# Altium project Mainboard.PrjPCB (part 1 of 2)
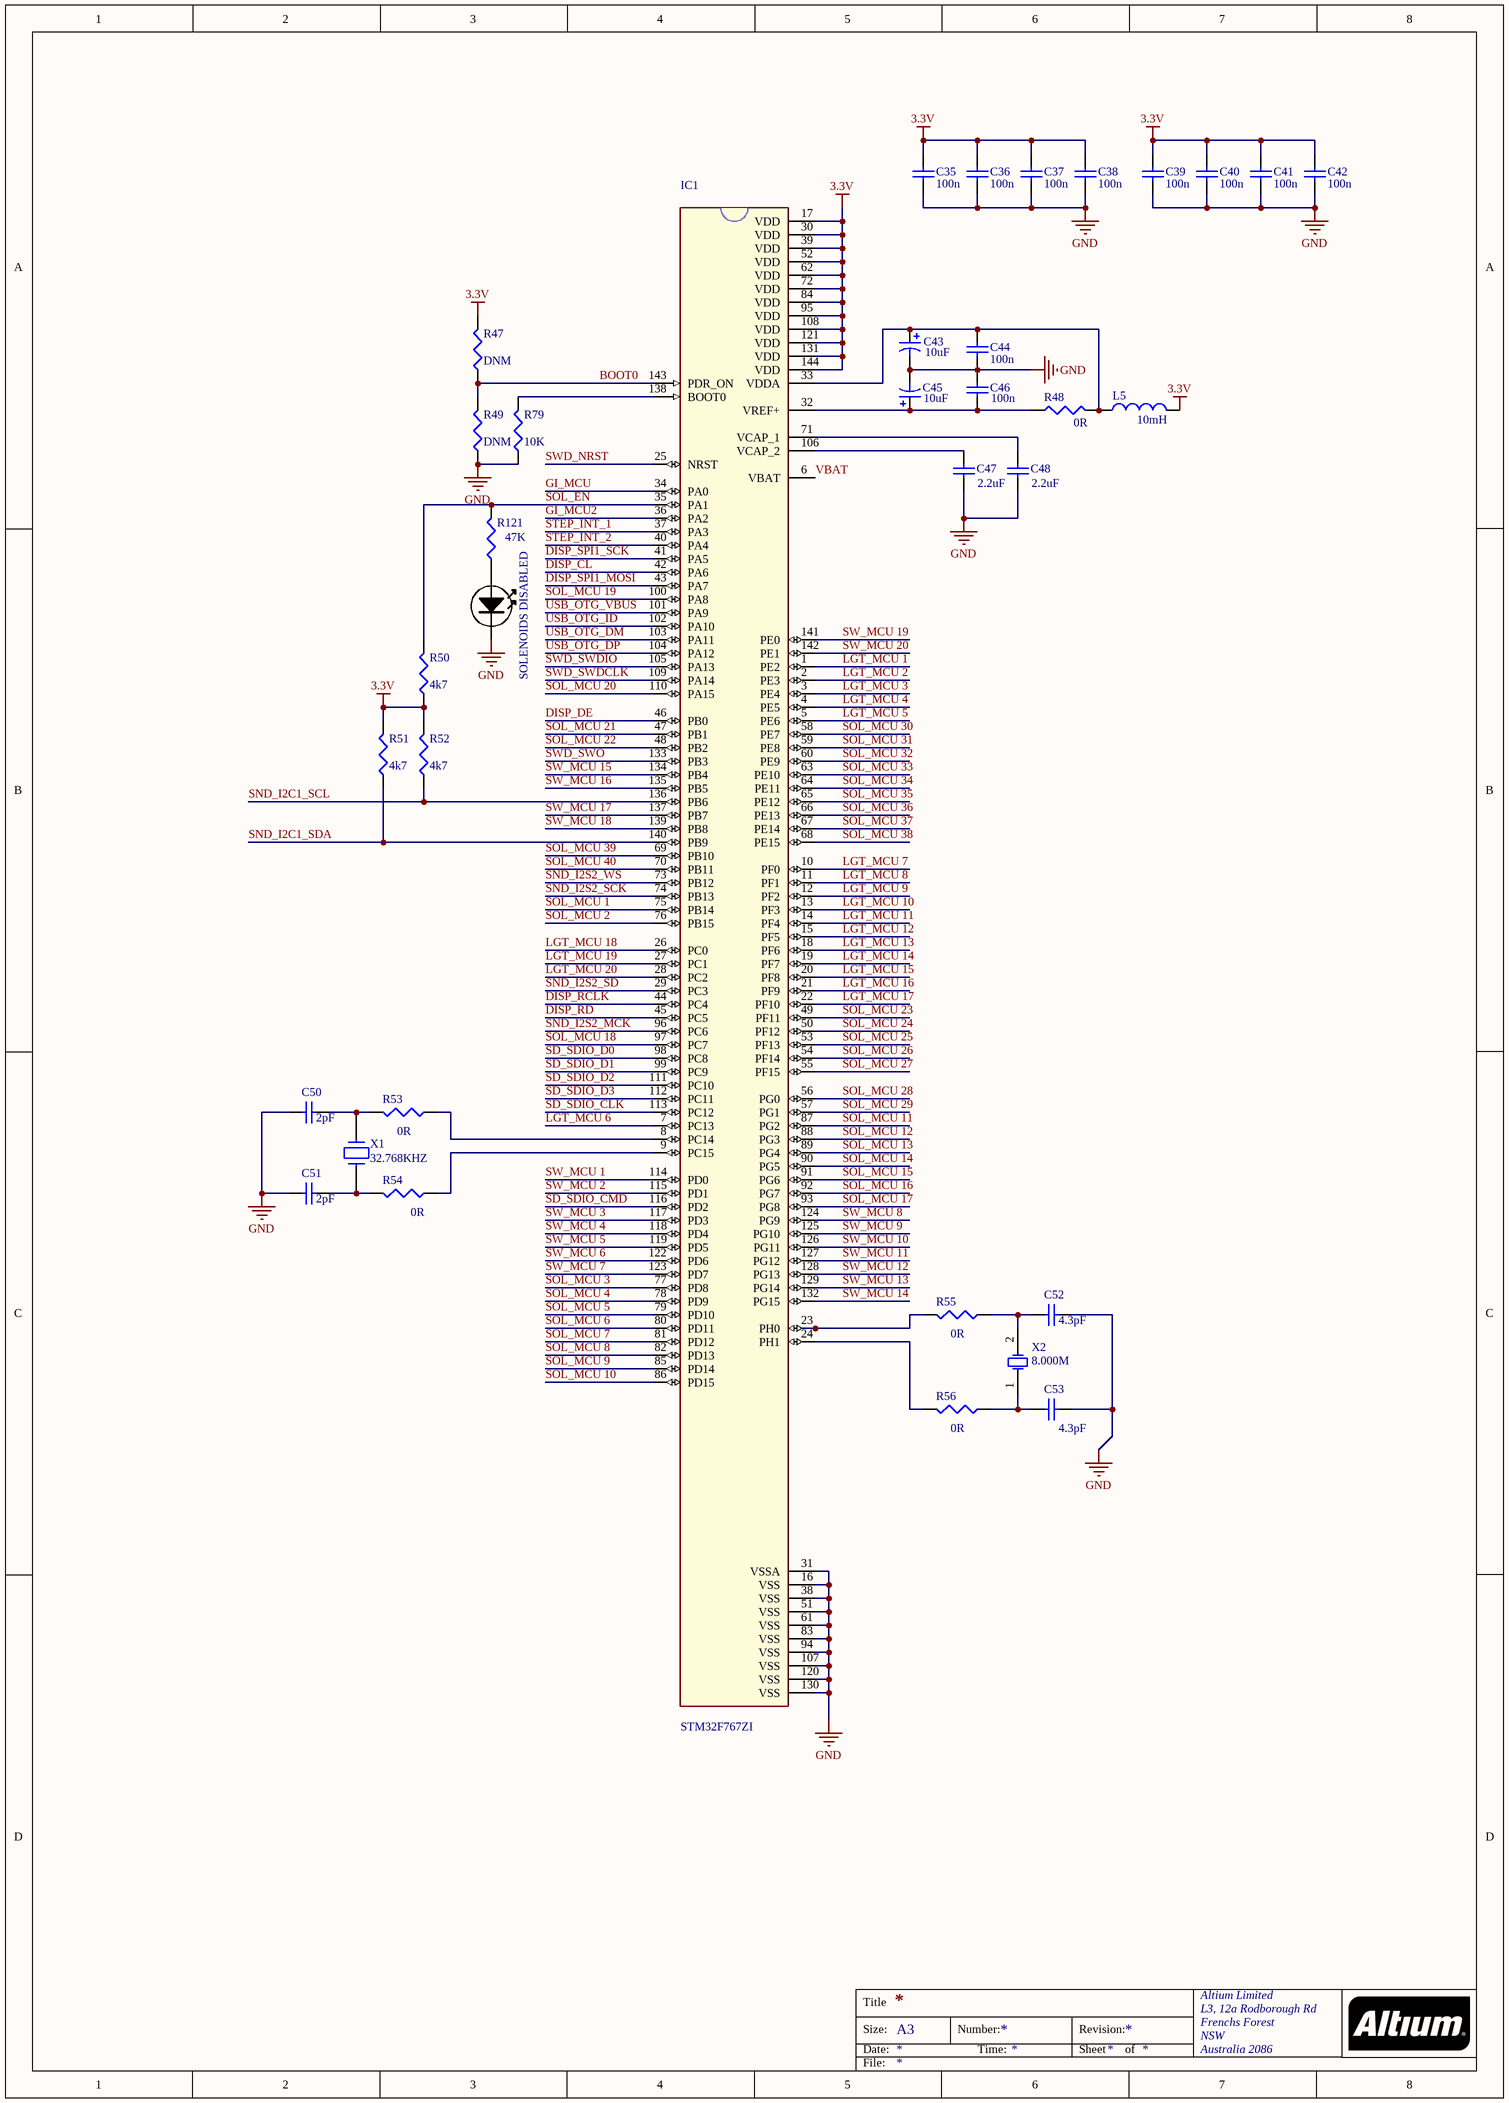
[diagram p0: Microcontroller.SchDoc]
8 sheets, 334 parts. Net scope: global (net labels, ports and power ports of the same name join across sheets).
Board file: PCB.PcbDoc
Sheets:
  Microcontroller.SchDoc
  Solenoid and Flasher Driver.SchDoc
  Dot Matrix Display Driver.SchDoc
  Connectors.SchDoc
  Stepper Motor Driver.SchDoc
  Switch Matrix Driver.SchDoc
  Lamp Matrix and GI Driver.SchDoc
  Digital Audio Amp.SchDoc

## Sheet Microcontroller.SchDoc
size A3 portrait; Organization: Altium Limited; Address1: L3, 12a Rodborough Rd; Address2: Frenchs Forest; Address3: NSW; Address4: Australia 2086

### Parts
C35  value 100n  [0805C-GENERIC]  (hidden comment: Cap Semi)
C36  value 100n  [0805C-GENERIC]  (hidden comment: Cap Semi)
C37  value 100n  [0805C-GENERIC]  (hidden comment: Cap Semi)
C38  value 100n  [0805C-GENERIC]  (hidden comment: Cap Semi)
C39  value 100n  [0805C-GENERIC]  (hidden comment: Cap Semi)
C40  value 100n  [0805C-GENERIC]  (hidden comment: Cap Semi)
C41  value 100n  [0805C-GENERIC]  (hidden comment: Cap Semi)
C42  value 100n  [0805C-GENERIC]  (hidden comment: Cap Semi)
C43  value 10uF  [0805C-GENERIC]  (hidden comment: Cap Pol3)
C44  value 100n  [0805C-GENERIC]  (hidden comment: Cap Semi)
C45  value 10uF  [0805C-GENERIC]  (hidden comment: Cap Pol3)
C46  value 100n  [0805C-GENERIC]  (hidden comment: Cap Semi)
C47  value 2.2uF  [0805C-GENERIC]  (hidden comment: Cap Semi)
C48  value 2.2uF  [0805C-GENERIC]  (hidden comment: Cap Semi)
C50  value 2pF  [0805C-GENERIC]  (hidden comment: Cap Semi)
C51  value 2pF  [0805C-GENERIC]  (hidden comment: Cap Semi)
C52  value 4.3pF  [0805C-GENERIC]  (hidden comment: Cap Semi)
C53  value 4.3pF  [0805C-GENERIC]  (hidden comment: Cap Semi)
IC1  STM32F767ZI  [TSQFP50P2200X2200X160-144N]
L5  value 10mH  [0805FB-GENERIC]  (hidden comment: Inductor)
R47  value DNM  [0805R-GENERIC]  (hidden comment: Res3)
R48  value 0R  [0805R-GENERIC]  (hidden comment: Res3)
R49  value DNM  [0805R-GENERIC]  (hidden comment: Res3)
R50  value 4k7  [0805R-GENERIC]  (hidden comment: Res3)
R51  value 4k7  [0805R-GENERIC]  (hidden comment: Res3)
R52  value 4k7  [0805R-GENERIC]  (hidden comment: Res3)
R53  value 0R  [0805R-GENERIC]  (hidden comment: Res3)
R54  value 0R  [0805R-GENERIC]  (hidden comment: Res3)
R55  value 0R  [0805R-GENERIC]  (hidden comment: Res3)
R56  value 0R  [0805R-GENERIC]  (hidden comment: Res3)
R79  value 10K  [0805R-GENERIC]  (hidden comment: Res3)
R121  value 47K  [0805R-GENERIC]  (hidden comment: Res3)
SOLENOIDS_DISABLED  LED-RED-3MM  [LED-3MM-RED]  (value not drawn)
X1  32.768KHZ  [XTAL_2SM_3R2X1R5]
X2  8.000M  [OSC_2SM_3R2x2R5]

### Nets
3.3V: C35.2 C36.2 C37.2 C38.2 C39.2 C40.2 C41.2 C42.2 IC1.17(VDD) IC1.30(VDD) IC1.39(VDD) IC1.52(VDD) IC1.62(VDD) IC1.72(VDD) IC1.84(VDD) IC1.95(VDD) IC1.108(VDD) IC1.121(VDD) IC1.131(VDD) IC1.144(VDD) L5.2 R47.2 R50.1 R51.2 R52.2
GND: C35.1 C36.1 C37.1 C38.1 C39.1 C40.1 C41.1 C42.1 C43.2 C44.1 C45.2 C46.2 C47.1 C48.1 C50.1 C51.1 C52.2 C53.2 IC1.16(VSS) IC1.31(VSSA) IC1.38(VSS) IC1.51(VSS) IC1.61(VSS) IC1.83(VSS) IC1.94(VSS) IC1.107(VSS) IC1.120(VSS) IC1.130(VSS) R49.1 R79.1 SOLENOIDS_DISABLED.K
BOOT0: IC1.143(PDR_ON) R47.1 R49.2
DISP_CL: IC1.42(PA6)
DISP_DE: IC1.46(PB0)
DISP_RCLK: IC1.44(PC4)
DISP_RD: IC1.45(PC5)
DISP_SPI1_MOSI: IC1.43(PA7)
DISP_SPI1_SCK: IC1.41(PA5)
GI_MCU: IC1.34(PA0)
GI_MCU2: IC1.36(PA2)
LGT_MCU 1: IC1.1(PE2)
LGT_MCU 2: IC1.2(PE3)
LGT_MCU 3: IC1.3(PE4)
LGT_MCU 4: IC1.4(PE5)
LGT_MCU 5: IC1.5(PE6)
LGT_MCU 6: IC1.7(PC13)
LGT_MCU 7: IC1.10(PF0)
LGT_MCU 8: IC1.11(PF1)
LGT_MCU 9: IC1.12(PF2)
LGT_MCU 10: IC1.13(PF3)
LGT_MCU 11: IC1.14(PF4)
LGT_MCU 12: IC1.15(PF5)
LGT_MCU 13: IC1.18(PF6)
LGT_MCU 14: IC1.19(PF7)
LGT_MCU 15: IC1.20(PF8)
LGT_MCU 16: IC1.21(PF9)
LGT_MCU 17: IC1.22(PF10)
LGT_MCU 18: IC1.26(PC0)
LGT_MCU 19: IC1.27(PC1)
LGT_MCU 20: IC1.28(PC2)
SD_SDIO_CLK: IC1.113(PC12)
SD_SDIO_CMD: IC1.116(PD2)
SD_SDIO_D0: IC1.98(PC8)
SD_SDIO_D1: IC1.99(PC9)
SD_SDIO_D2: IC1.111(PC10)
SD_SDIO_D3: IC1.112(PC11)
SND_I2C1_SCL: IC1.136(PB6) R52.1
SND_I2C1_SDA: IC1.140(PB9) R51.1
SND_I2S2_MCK: IC1.96(PC6)
SND_I2S2_SCK: IC1.74(PB13)
SND_I2S2_SD: IC1.29(PC3)
SND_I2S2_WS: IC1.73(PB12)
SOL_EN: IC1.35(PA1) R50.2 R121.2
SOL_MCU 1: IC1.75(PB14)
SOL_MCU 2: IC1.76(PB15)
SOL_MCU 3: IC1.77(PD8)
SOL_MCU 4: IC1.78(PD9)
SOL_MCU 5: IC1.79(PD10)
SOL_MCU 6: IC1.80(PD11)
SOL_MCU 7: IC1.81(PD12)
SOL_MCU 8: IC1.82(PD13)
SOL_MCU 9: IC1.85(PD14)
SOL_MCU 10: IC1.86(PD15)
SOL_MCU 11: IC1.87(PG2)
SOL_MCU 12: IC1.88(PG3)
SOL_MCU 13: IC1.89(PG4)
SOL_MCU 14: IC1.90(PG5)
SOL_MCU 15: IC1.91(PG6)
SOL_MCU 16: IC1.92(PG7)
SOL_MCU 17: IC1.93(PG8)
SOL_MCU 18: IC1.97(PC7)
SOL_MCU 19: IC1.100(PA8)
SOL_MCU 20: IC1.110(PA15)
SOL_MCU 21: IC1.47(PB1)
SOL_MCU 22: IC1.48(PB2)
SOL_MCU 23: IC1.49(PF11)
SOL_MCU 24: IC1.50(PF12)
SOL_MCU 25: IC1.53(PF13)
SOL_MCU 26: IC1.54(PF14)
SOL_MCU 27: IC1.55(PF15)
SOL_MCU 28: IC1.56(PG0)
SOL_MCU 29: IC1.57(PG1)
SOL_MCU 30: IC1.58(PE7)
SOL_MCU 31: IC1.59(PE8)
SOL_MCU 32: IC1.60(PE9)
SOL_MCU 33: IC1.63(PE10)
SOL_MCU 34: IC1.64(PE11)
SOL_MCU 35: IC1.65(PE12)
SOL_MCU 36: IC1.66(PE13)
SOL_MCU 37: IC1.67(PE14)
SOL_MCU 38: IC1.68(PE15)
SOL_MCU 39: IC1.69(PB10)
SOL_MCU 40: IC1.70(PB11)
STEP_INT_1: IC1.37(PA3)
STEP_INT_2: IC1.40(PA4)
SW_MCU 1: IC1.114(PD0)
SW_MCU 2: IC1.115(PD1)
SW_MCU 3: IC1.117(PD3)
SW_MCU 4: IC1.118(PD4)
SW_MCU 5: IC1.119(PD5)
SW_MCU 6: IC1.122(PD6)
SW_MCU 7: IC1.123(PD7)
SW_MCU 8: IC1.124(PG9)
SW_MCU 9: IC1.125(PG10)
SW_MCU 10: IC1.126(PG11)
SW_MCU 11: IC1.127(PG12)
SW_MCU 12: IC1.128(PG13)
SW_MCU 13: IC1.129(PG14)
SW_MCU 14: IC1.132(PG15)
SW_MCU 15: IC1.134(PB4)
SW_MCU 16: IC1.135(PB5)
SW_MCU 17: IC1.137(PB7)
SW_MCU 18: IC1.139(PB8)
SW_MCU 19: IC1.141(PE0)
SW_MCU 20: IC1.142(PE1)
SWD_NRST: IC1.25(NRST)
SWD_SWDCLK: IC1.109(PA14)
SWD_SWDIO: IC1.105(PA13)
SWD_SWO: IC1.133(PB3)
USB_OTG_DM: IC1.103(PA11)
USB_OTG_DP: IC1.104(PA12)
USB_OTG_ID: IC1.102(PA10)
USB_OTG_VBUS: IC1.101(PA9)
VBAT: IC1.6(VBAT)
NetC43_1: C43.1 C44.2 IC1.33(VDDA) L5.1 R48.2
NetC45_1: C45.1 C46.1 IC1.32(VREF+) R48.1
NetC47_2: C47.2 IC1.106(VCAP_2)
NetC48_2: C48.2 IC1.71(VCAP_1)
NetC50_2: C50.2 R53.2 X1.2
NetC51_2: C51.2 R54.2 X1.1
NetC52_1: C52.1 R55.1 X2.2(OSC2)
NetC53_1: C53.1 R56.1 X2.1(OSC1)
NetIC1_8: IC1.8(PC14) R53.1
NetIC1_9: IC1.9(PC15) R54.1
NetIC1_23: IC1.23(PH0) R55.2
NetIC1_24: IC1.24(PH1) R56.2
NetIC1_138: IC1.138(BOOT0) R79.2
NetR121_1: R121.1 SOLENOIDS_DISABLED.A

### Notes on the sheet
- Title
- Size:
- Date:
- A3
- Number:
- Time:
- Revision:
- Sheet
- of
- File:

### Library data of the parts
C35-C42 C44 C46-C48 C50-C53 = Cap Semi: Capacitor (Semiconductor SIM Model); Published: 8-Jun-2000; LatestRevisionDate: 29-May-2009; LatestRevisionNote: IPC-7351 Footprint Added.; PackageReference: C1206; Publisher: Altium Limited; PackageDescription: Chip Capacitor
C43 C45 = Cap Pol3: Polarized Capacitor (Surface Mount); Published: 8-Jun-2000; LatestRevisionDate: 29-May-2009; LatestRevisionNote: IPC-7351 Footprint Added.; PackageReference: C0805; Publisher: Altium Limited; PackageDescription: Chip Capacitor
IC1 = STM32F407ZGT6: IC MCU 32BIT 1MB FLASH 144LQFP; MF: STMicroelectronics; MP: STM32F407ZGT6; Availability: Good; Package: LQFP-144 STMicroelectronics; Price: 11.63 USD; Value: *
L5 = Inductor: Code_IEC: 1005; Published: 8-Jun-2000; LatestRevisionDate: 29-May-2009; LatestRevisionNote: IPC-7351 Footprint Added.; PackageReference: 0402-A; Publisher: Altium Limited; PackageDescription: Chip Inductor; Code_JEITA: 0402
R47-R56 R79 R121 = Res3: Resistor; Published: 8-Jun-2000; LatestRevisionDate: 29-May-2009; LatestRevisionNote: IPC-7351 Footprint Added.; PackageReference: J1-0603; Publisher: Altium Limited; PackageDescription: Chip Resistor
X1 = CRYSTAL_32K: Crystal
X2 = XTAL: Crystal Oscillator; Published: 8-Jun-2000; LatestRevisionDate: 17-Jul-2002; LatestRevisionNote: Re-released for DXP Platform.; PackageReference: R38; Publisher: Altium Limited

## Sheet Solenoid and Flasher Driver.SchDoc
size A3 portrait; Organization: Altium Limited; Address1: L3, 12a Rodborough Rd; Address2: Frenchs Forest; Address3: NSW; Address4: Australia 2086
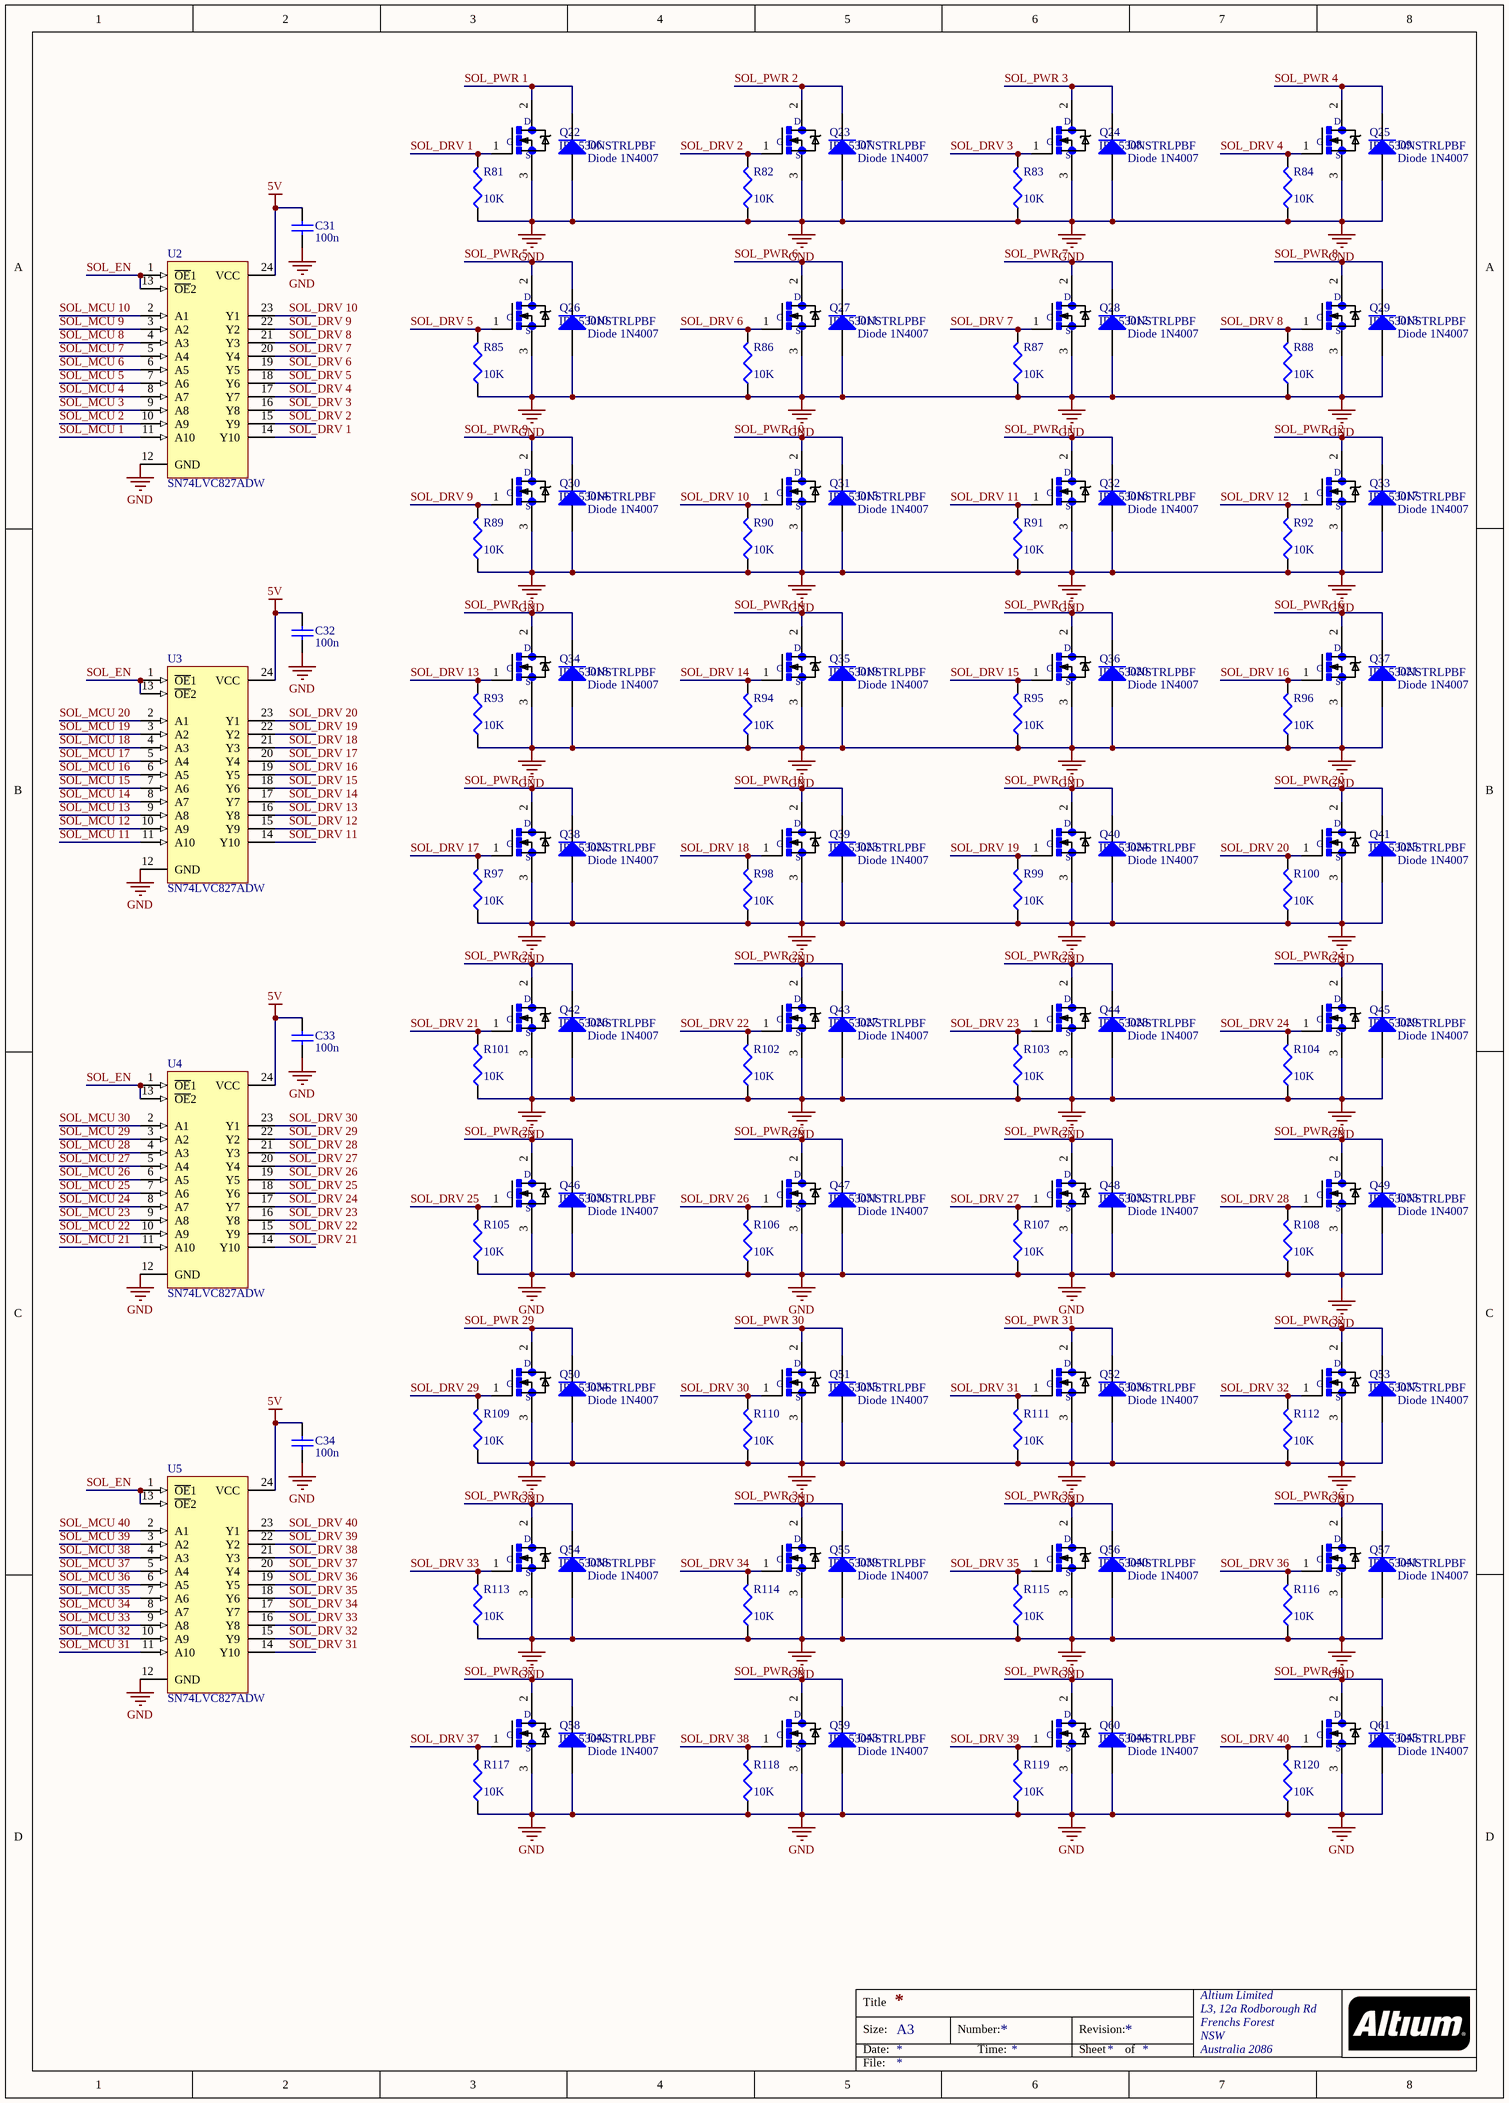
[diagram p1: Solenoid and Flasher Driver.SchDoc]

### Parts
C31  value 100n  [0805C-GENERIC]  (hidden comment: Cap Semi)
C32  value 100n  [0805C-GENERIC]  (hidden comment: Cap Semi)
C33  value 100n  [0805C-GENERIC]  (hidden comment: Cap Semi)
C34  value 100n  [0805C-GENERIC]  (hidden comment: Cap Semi)
D6  Diode 1N4007  [DO-41]
D7  Diode 1N4007  [DO-41]
D8  Diode 1N4007  [DO-41]
D9  Diode 1N4007  [DO-41]
D10  Diode 1N4007  [DO-41]
D11  Diode 1N4007  [DO-41]
D12  Diode 1N4007  [DO-41]
D13  Diode 1N4007  [DO-41]
D14  Diode 1N4007  [DO-41]
D15  Diode 1N4007  [DO-41]
D16  Diode 1N4007  [DO-41]
D17  Diode 1N4007  [DO-41]
D18  Diode 1N4007  [DO-41]
D19  Diode 1N4007  [DO-41]
D20  Diode 1N4007  [DO-41]
D21  Diode 1N4007  [DO-41]
D22  Diode 1N4007  [DO-41]
D23  Diode 1N4007  [DO-41]
D24  Diode 1N4007  [DO-41]
D25  Diode 1N4007  [DO-41]
D26  Diode 1N4007  [DO-41]
D27  Diode 1N4007  [DO-41]
D28  Diode 1N4007  [DO-41]
D29  Diode 1N4007  [DO-41]
D30  Diode 1N4007  [DO-41]
D31  Diode 1N4007  [DO-41]
D32  Diode 1N4007  [DO-41]
D33  Diode 1N4007  [DO-41]
D34  Diode 1N4007  [DO-41]
D35  Diode 1N4007  [DO-41]
D36  Diode 1N4007  [DO-41]
D37  Diode 1N4007  [DO-41]
D38  Diode 1N4007  [DO-41]
D39  Diode 1N4007  [DO-41]
D40  Diode 1N4007  [DO-41]
D41  Diode 1N4007  [DO-41]
D42  Diode 1N4007  [DO-41]
D43  Diode 1N4007  [DO-41]
D44  Diode 1N4007  [DO-41]
D45  Diode 1N4007  [DO-41]
Q22  IRL530NSTRLPBF  [TO-220AB]
Q23  IRL530NSTRLPBF  [TO-220AB]
Q24  IRL530NSTRLPBF  [TO-220AB]
Q25  IRL530NSTRLPBF  [TO-220AB]
Q26  IRL530NSTRLPBF  [TO-220AB]
Q27  IRL530NSTRLPBF  [TO-220AB]
Q28  IRL530NSTRLPBF  [TO-220AB]
Q29  IRL530NSTRLPBF  [TO-220AB]
Q30  IRL530NSTRLPBF  [TO-220AB]
Q31  IRL530NSTRLPBF  [TO-220AB]
Q32  IRL530NSTRLPBF  [TO-220AB]
Q33  IRL530NSTRLPBF  [TO-220AB]
Q34  IRL530NSTRLPBF  [TO-220AB]
Q35  IRL530NSTRLPBF  [TO-220AB]
Q36  IRL530NSTRLPBF  [TO-220AB]
Q37  IRL530NSTRLPBF  [TO-220AB]
Q38  IRL530NSTRLPBF  [TO-220AB]
Q39  IRL530NSTRLPBF  [TO-220AB]
Q40  IRL530NSTRLPBF  [TO-220AB]
Q41  IRL530NSTRLPBF  [TO-220AB]
Q42  IRL530NSTRLPBF  [TO-220AB]
Q43  IRL530NSTRLPBF  [TO-220AB]
Q44  IRL530NSTRLPBF  [TO-220AB]
Q45  IRL530NSTRLPBF  [TO-220AB]
Q46  IRL530NSTRLPBF  [TO-220AB]
Q47  IRL530NSTRLPBF  [TO-220AB]
Q48  IRL530NSTRLPBF  [TO-220AB]
Q49  IRL530NSTRLPBF  [TO-220AB]
Q50  IRL530NSTRLPBF  [TO-220AB]
Q51  IRL530NSTRLPBF  [TO-220AB]
Q52  IRL530NSTRLPBF  [TO-220AB]
Q53  IRL530NSTRLPBF  [TO-220AB]
Q54  IRL530NSTRLPBF  [TO-220AB]
Q55  IRL530NSTRLPBF  [TO-220AB]
Q56  IRL530NSTRLPBF  [TO-220AB]
Q57  IRL530NSTRLPBF  [TO-220AB]
Q58  IRL530NSTRLPBF  [TO-220AB]
Q59  IRL530NSTRLPBF  [TO-220AB]
Q60  IRL530NSTRLPBF  [TO-220AB]
Q61  IRL530NSTRLPBF  [TO-220AB]
R81  value 10K  [0805R-GENERIC]  (hidden comment: Res3)
R82  value 10K  [0805R-GENERIC]  (hidden comment: Res3)
R83  value 10K  [0805R-GENERIC]  (hidden comment: Res3)
R84  value 10K  [0805R-GENERIC]  (hidden comment: Res3)
R85  value 10K  [0805R-GENERIC]  (hidden comment: Res3)
R86  value 10K  [0805R-GENERIC]  (hidden comment: Res3)
R87  value 10K  [0805R-GENERIC]  (hidden comment: Res3)
R88  value 10K  [0805R-GENERIC]  (hidden comment: Res3)
R89  value 10K  [0805R-GENERIC]  (hidden comment: Res3)
R90  value 10K  [0805R-GENERIC]  (hidden comment: Res3)
R91  value 10K  [0805R-GENERIC]  (hidden comment: Res3)
R92  value 10K  [0805R-GENERIC]  (hidden comment: Res3)
R93  value 10K  [0805R-GENERIC]  (hidden comment: Res3)
R94  value 10K  [0805R-GENERIC]  (hidden comment: Res3)
R95  value 10K  [0805R-GENERIC]  (hidden comment: Res3)
R96  value 10K  [0805R-GENERIC]  (hidden comment: Res3)
R97  value 10K  [0805R-GENERIC]  (hidden comment: Res3)
R98  value 10K  [0805R-GENERIC]  (hidden comment: Res3)
R99  value 10K  [0805R-GENERIC]  (hidden comment: Res3)
R100  value 10K  [0805R-GENERIC]  (hidden comment: Res3)
R101  value 10K  [0805R-GENERIC]  (hidden comment: Res3)
R102  value 10K  [0805R-GENERIC]  (hidden comment: Res3)
R103  value 10K  [0805R-GENERIC]  (hidden comment: Res3)
R104  value 10K  [0805R-GENERIC]  (hidden comment: Res3)
R105  value 10K  [0805R-GENERIC]  (hidden comment: Res3)
R106  value 10K  [0805R-GENERIC]  (hidden comment: Res3)
R107  value 10K  [0805R-GENERIC]  (hidden comment: Res3)
R108  value 10K  [0805R-GENERIC]  (hidden comment: Res3)
R109  value 10K  [0805R-GENERIC]  (hidden comment: Res3)
R110  value 10K  [0805R-GENERIC]  (hidden comment: Res3)
R111  value 10K  [0805R-GENERIC]  (hidden comment: Res3)
R112  value 10K  [0805R-GENERIC]  (hidden comment: Res3)
R113  value 10K  [0805R-GENERIC]  (hidden comment: Res3)
R114  value 10K  [0805R-GENERIC]  (hidden comment: Res3)
R115  value 10K  [0805R-GENERIC]  (hidden comment: Res3)
R116  value 10K  [0805R-GENERIC]  (hidden comment: Res3)
R117  value 10K  [0805R-GENERIC]  (hidden comment: Res3)
R118  value 10K  [0805R-GENERIC]  (hidden comment: Res3)
R119  value 10K  [0805R-GENERIC]  (hidden comment: Res3)
R120  value 10K  [0805R-GENERIC]  (hidden comment: Res3)
U2  SN74LVC827ADW  [SOIC24]
U3  SN74LVC827ADW  [SOIC24]
U4  SN74LVC827ADW  [SOIC24]
U5  SN74LVC827ADW  [SOIC24]

### Nets
5V: C31.2 C32.2 C33.2 C34.2 U2.24(VCC) U3.24(VCC) U4.24(VCC) U5.24(VCC)
GND: C31.1 C32.1 C33.1 C34.1 D6.1(A) D7.1(A) D8.1(A) D9.1(A) D10.1(A) D11.1(A) D12.1(A) D13.1(A) D14.1(A) D15.1(A) D16.1(A) D17.1(A) D18.1(A) D19.1(A) D20.1(A) D21.1(A) D22.1(A) D23.1(A) D24.1(A) D25.1(A) D26.1(A) D27.1(A) D28.1(A) D29.1(A) D30.1(A) D31.1(A) D32.1(A) D33.1(A) D34.1(A) D35.1(A) D36.1(A) D37.1(A) D38.1(A) D39.1(A) D40.1(A) D41.1(A) D42.1(A) D43.1(A) D44.1(A) D45.1(A) Q22.3(S) Q23.3(S) Q24.3(S) Q25.3(S) Q26.3(S) Q27.3(S) Q28.3(S) Q29.3(S) Q30.3(S) Q31.3(S) Q32.3(S) Q33.3(S) Q34.3(S) Q35.3(S) Q36.3(S) Q37.3(S) Q38.3(S) Q39.3(S) Q40.3(S) Q41.3(S) Q42.3(S) Q43.3(S) Q44.3(S) Q45.3(S) Q46.3(S) Q47.3(S) Q48.3(S) Q49.3(S) Q50.3(S) Q51.3(S) Q52.3(S) Q53.3(S) Q54.3(S) Q55.3(S) Q56.3(S) Q57.3(S) Q58.3(S) Q59.3(S) Q60.3(S) Q61.3(S) R81.1 R82.1 R83.1 R84.1 R85.1 R86.1 R87.1 R88.1 R89.1 R90.1 R91.1 R92.1 R93.1 R94.1 R95.1 R96.1 R97.1 R98.1 R99.1 R100.1 R101.1 R102.1 R103.1 R104.1 R105.1 R106.1 R107.1 R108.1 R109.1 R110.1 R111.1 R112.1 R113.1 R114.1 R115.1 R116.1 R117.1 R118.1 R119.1 R120.1 U2.12(GND) U3.12(GND) U4.12(GND) U5.12(GND)
SOL_DRV 1: Q22.1(G) R81.2 U2.14(Y10)
SOL_DRV 2: Q23.1(G) R82.2 U2.15(Y9)
SOL_DRV 3: Q24.1(G) R83.2 U2.16(Y8)
SOL_DRV 4: Q25.1(G) R84.2 U2.17(Y7)
SOL_DRV 5: Q26.1(G) R85.2 U2.18(Y6)
SOL_DRV 6: Q27.1(G) R86.2 U2.19(Y5)
SOL_DRV 7: Q28.1(G) R87.2 U2.20(Y4)
SOL_DRV 8: Q29.1(G) R88.2 U2.21(Y3)
SOL_DRV 9: Q30.1(G) R89.2 U2.22(Y2)
SOL_DRV 10: Q31.1(G) R90.2 U2.23(Y1)
SOL_DRV 11: Q32.1(G) R91.2 U3.14(Y10)
SOL_DRV 12: Q33.1(G) R92.2 U3.15(Y9)
SOL_DRV 13: Q34.1(G) R93.2 U3.16(Y8)
SOL_DRV 14: Q35.1(G) R94.2 U3.17(Y7)
SOL_DRV 15: Q36.1(G) R95.2 U3.18(Y6)
SOL_DRV 16: Q37.1(G) R96.2 U3.19(Y5)
SOL_DRV 17: Q38.1(G) R97.2 U3.20(Y4)
SOL_DRV 18: Q39.1(G) R98.2 U3.21(Y3)
SOL_DRV 19: Q40.1(G) R99.2 U3.22(Y2)
SOL_DRV 20: Q41.1(G) R100.2 U3.23(Y1)
SOL_DRV 21: Q42.1(G) R101.2 U4.14(Y10)
SOL_DRV 22: Q43.1(G) R102.2 U4.15(Y9)
SOL_DRV 23: Q44.1(G) R103.2 U4.16(Y8)
SOL_DRV 24: Q45.1(G) R104.2 U4.17(Y7)
SOL_DRV 25: Q46.1(G) R105.2 U4.18(Y6)
SOL_DRV 26: Q47.1(G) R106.2 U4.19(Y5)
SOL_DRV 27: Q48.1(G) R107.2 U4.20(Y4)
SOL_DRV 28: Q49.1(G) R108.2 U4.21(Y3)
SOL_DRV 29: Q50.1(G) R109.2 U4.22(Y2)
SOL_DRV 30: Q51.1(G) R110.2 U4.23(Y1)
SOL_DRV 31: Q52.1(G) R111.2 U5.14(Y10)
SOL_DRV 32: Q53.1(G) R112.2 U5.15(Y9)
SOL_DRV 33: Q54.1(G) R113.2 U5.16(Y8)
SOL_DRV 34: Q55.1(G) R114.2 U5.17(Y7)
SOL_DRV 35: Q56.1(G) R115.2 U5.18(Y6)
SOL_DRV 36: Q57.1(G) R116.2 U5.19(Y5)
SOL_DRV 37: Q58.1(G) R117.2 U5.20(Y4)
SOL_DRV 38: Q59.1(G) R118.2 U5.21(Y3)
SOL_DRV 39: Q60.1(G) R119.2 U5.22(Y2)
SOL_DRV 40: Q61.1(G) R120.2 U5.23(Y1)
SOL_EN: U2.1(~{OE}1) U2.13(~{OE}2) U3.1(~{OE}1) U3.13(~{OE}2) U4.1(~{OE}1) U4.13(~{OE}2) U5.1(~{OE}1) U5.13(~{OE}2)
SOL_MCU 1: U2.11(A10)
SOL_MCU 2: U2.10(A9)
SOL_MCU 3: U2.9(A8)
SOL_MCU 4: U2.8(A7)
SOL_MCU 5: U2.7(A6)
SOL_MCU 6: U2.6(A5)
SOL_MCU 7: U2.5(A4)
SOL_MCU 8: U2.4(A3)
SOL_MCU 9: U2.3(A2)
SOL_MCU 10: U2.2(A1)
SOL_MCU 11: U3.11(A10)
SOL_MCU 12: U3.10(A9)
SOL_MCU 13: U3.9(A8)
SOL_MCU 14: U3.8(A7)
SOL_MCU 15: U3.7(A6)
SOL_MCU 16: U3.6(A5)
SOL_MCU 17: U3.5(A4)
SOL_MCU 18: U3.4(A3)
SOL_MCU 19: U3.3(A2)
SOL_MCU 20: U3.2(A1)
SOL_MCU 21: U4.11(A10)
SOL_MCU 22: U4.10(A9)
SOL_MCU 23: U4.9(A8)
SOL_MCU 24: U4.8(A7)
SOL_MCU 25: U4.7(A6)
SOL_MCU 26: U4.6(A5)
SOL_MCU 27: U4.5(A4)
SOL_MCU 28: U4.4(A3)
SOL_MCU 29: U4.3(A2)
SOL_MCU 30: U4.2(A1)
SOL_MCU 31: U5.11(A10)
SOL_MCU 32: U5.10(A9)
SOL_MCU 33: U5.9(A8)
SOL_MCU 34: U5.8(A7)
SOL_MCU 35: U5.7(A6)
SOL_MCU 36: U5.6(A5)
SOL_MCU 37: U5.5(A4)
SOL_MCU 38: U5.4(A3)
SOL_MCU 39: U5.3(A2)
SOL_MCU 40: U5.2(A1)
SOL_PWR 1: D6.2(K) Q22.2(D)
SOL_PWR 2: D7.2(K) Q23.2(D)
SOL_PWR 3: D8.2(K) Q24.2(D)
SOL_PWR 4: D9.2(K) Q25.2(D)
SOL_PWR 5: D10.2(K) Q26.2(D)
SOL_PWR 6: D11.2(K) Q27.2(D)
SOL_PWR 7: D12.2(K) Q28.2(D)
SOL_PWR 8: D13.2(K) Q29.2(D)
SOL_PWR 9: D14.2(K) Q30.2(D)
SOL_PWR 10: D15.2(K) Q31.2(D)
SOL_PWR 11: D16.2(K) Q32.2(D)
SOL_PWR 12: D17.2(K) Q33.2(D)
SOL_PWR 13: D18.2(K) Q34.2(D)
SOL_PWR 14: D19.2(K) Q35.2(D)
SOL_PWR 15: D20.2(K) Q36.2(D)
SOL_PWR 16: D21.2(K) Q37.2(D)
SOL_PWR 17: D22.2(K) Q38.2(D)
SOL_PWR 18: D23.2(K) Q39.2(D)
SOL_PWR 19: D24.2(K) Q40.2(D)
SOL_PWR 20: D25.2(K) Q41.2(D)
SOL_PWR 21: D26.2(K) Q42.2(D)
SOL_PWR 22: D27.2(K) Q43.2(D)
SOL_PWR 23: D28.2(K) Q44.2(D)
SOL_PWR 24: D29.2(K) Q45.2(D)
SOL_PWR 25: D30.2(K) Q46.2(D)
SOL_PWR 26: D31.2(K) Q47.2(D)
SOL_PWR 27: D32.2(K) Q48.2(D)
SOL_PWR 28: D33.2(K) Q49.2(D)
SOL_PWR 29: D34.2(K) Q50.2(D)
SOL_PWR 30: D35.2(K) Q51.2(D)
SOL_PWR 31: D36.2(K) Q52.2(D)
SOL_PWR 32: D37.2(K) Q53.2(D)
SOL_PWR 33: D38.2(K) Q54.2(D)
SOL_PWR 34: D39.2(K) Q55.2(D)
SOL_PWR 35: D40.2(K) Q56.2(D)
SOL_PWR 36: D41.2(K) Q57.2(D)
SOL_PWR 37: D42.2(K) Q58.2(D)
SOL_PWR 38: D43.2(K) Q59.2(D)
SOL_PWR 39: D44.2(K) Q60.2(D)
SOL_PWR 40: D45.2(K) Q61.2(D)

### Notes on the sheet
- Title
- Size:
- Date:
- A3
- Number:
- Time:
- Revision:
- Sheet
- of
- File:

### Library data of the parts
C31-C34 = Cap Semi: Capacitor (Semiconductor SIM Model); Published: 8-Jun-2000; LatestRevisionDate: 29-May-2009; LatestRevisionNote: IPC-7351 Footprint Added.; PackageReference: C1206; Publisher: Altium Limited; PackageDescription: Chip Capacitor
D6-D45 = Diode 1N4007: 1 Amp General Purpose Rectifier; Published: 8-Jun-2000; LatestRevisionDate: 17-Jul-2002; LatestRevisionNote: Re-released for DXP Platform.; DatasheetVersion: 1998; PackageVersion: Aug-1999; PackageReference: DO-41; Publisher: Altium Limited; PackageDescription: Diode, Axial; Body 5.2 x 2.7 mm (LxDia. max), Lead Dia. 0.86 mm (max); Code_JEDEC: DO-204-AL; ComponentLink1Description: Manufacturer Link; ComponentLink1URL: http://www.fairchildsemi.com/; ComponentLink2Description: Datasheet; ComponentLink2URL: http://www.fairchildsemi.com/ds/1N%2F1N4001.pdf
Q22-Q61 = IRL530NSTRLPBF: MOSFET N-CH 100V 17A D2PAK; MF: Infineon; Price: 0.79 USD; Package: D2PAK Infineon; Availability: Good; MP: IRL530NSTRLPBF; Value: *
R81-R120 = Res3: Resistor; Published: 8-Jun-2000; LatestRevisionDate: 29-May-2009; LatestRevisionNote: IPC-7351 Footprint Added.; PackageReference: J1-0603; Publisher: Altium Limited; PackageDescription: Chip Resistor
U2-U5 = SN74LVC827ADW: 10-Bit Buffer/Driver with 3-State Outputs; Published: 8-Jun-2000; LatestRevisionDate: 13-Apr-2006; LatestRevisionNote: IPC-7351 Footprint Added.; DatasheetVersion: Jun-1998; PackageVersion: Mar-2000; PackageReference: DW024; Publisher: Altium Limited; PackageDescription: 24-Pin Plastic Small Outline Integrated Circuit 1.27 mm Pitch; Code_JEDEC: MS-013; ComponentLink1Description: Manufacturer Link; ComponentLink1URL: http://www.ti.com/; ComponentLink2Description: Datasheet; ComponentLink2URL: http://www-s.ti.com/sc/ds/sn74lvc827a.pdf

## Sheet Dot Matrix Display Driver.SchDoc
size A4
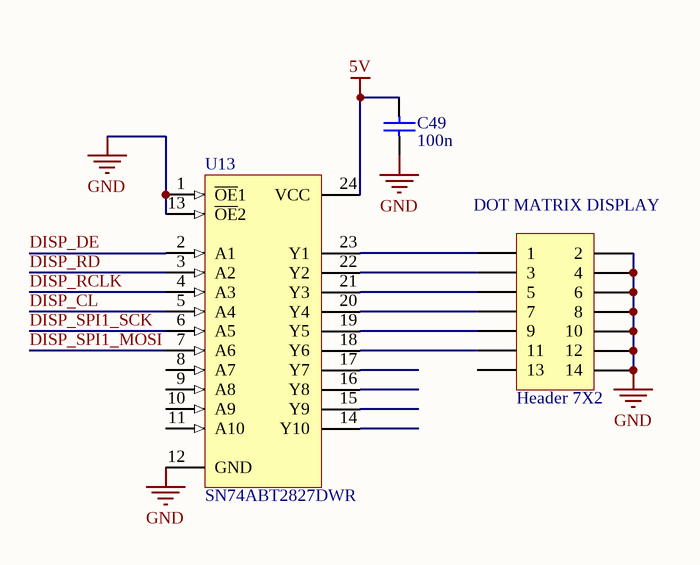
[diagram p2: Dot Matrix Display Driver.SchDoc]

### Parts
C49  value 100n  [0805C-GENERIC]  (hidden comment: Cap Semi)
DOT_MATRIX_DISPLAY  Header 7X2  [IDC14-B]
U13  SN74ABT2827DWR  [SOIC24]

### Nets
5V: C49.2 U13.24(VCC)
GND: C49.1 DOT_MATRIX_DISPLAY.2 DOT_MATRIX_DISPLAY.4 DOT_MATRIX_DISPLAY.6 DOT_MATRIX_DISPLAY.8 DOT_MATRIX_DISPLAY.10 DOT_MATRIX_DISPLAY.12 DOT_MATRIX_DISPLAY.14 U13.1(~{OE}1) U13.12(GND) U13.13(~{OE}2)
DISP_CL: U13.5(A4)
DISP_DE: U13.2(A1)
DISP_RCLK: U13.4(A3)
DISP_RD: U13.3(A2)
DISP_SPI1_MOSI: U13.7(A6)
DISP_SPI1_SCK: U13.6(A5)
NetDOT_MATRIX_DISPLAY_1: DOT_MATRIX_DISPLAY.1 U13.23(Y1)
NetDOT_MATRIX_DISPLAY_3: DOT_MATRIX_DISPLAY.3 U13.22(Y2)
NetDOT_MATRIX_DISPLAY_5: DOT_MATRIX_DISPLAY.5 U13.21(Y3)
NetDOT_MATRIX_DISPLAY_7: DOT_MATRIX_DISPLAY.7 U13.20(Y4)
NetDOT_MATRIX_DISPLAY_9: DOT_MATRIX_DISPLAY.9 U13.19(Y5)
NetDOT_MATRIX_DISPLAY_11: DOT_MATRIX_DISPLAY.11 U13.18(Y6)

Not connected (* = marked no-connect by the designer): DOT_MATRIX_DISPLAY 13; U13 8(A7) 9(A8) 10(A9) 11(A10) 14(Y10) 15(Y9) 16(Y8) 17(Y7)

### Library data of the parts
C49 = Cap Semi: Capacitor (Semiconductor SIM Model); Published: 8-Jun-2000; LatestRevisionDate: 29-May-2009; LatestRevisionNote: IPC-7351 Footprint Added.; PackageReference: C1206; Publisher: Altium Limited; PackageDescription: Chip Capacitor
DOT_MATRIX_DISPLAY = Header 7X2: Header, 7-Pin, Dual row; LatestRevisionDate: 17-Jul-2002; LatestRevisionNote: Re-released for DXP Platform.; Publisher: Altium Limited
U13 = SN74LVC827ADW: as U2 on sheet Solenoid and Flasher Driver; Published: 8-Jun-2000; LatestRevisionDate: 13-Apr-2006; LatestRevisionNote: IPC-7351 Footprint Added.; DatasheetVersion: Jun-1998; PackageVersion: Mar-2000; PackageReference: DW024; Publisher: Altium Limited; PackageDescription: 24-Pin Plastic Small Outline Integrated Circuit 1.27 mm Pitch; Code_JEDEC: MS-013; ComponentLink1Description: Manufacturer Link; ComponentLink1URL: http://www.ti.com/; ComponentLink2Description: Datasheet; ComponentLink2URL: http://www-s.ti.com/sc/ds/sn74lvc827a.pdf

## Sheet Connectors.SchDoc
size A4; Organization: Altium Limited; Address1: L3, 12a Rodborough Rd; Address2: Frenchs Forest; Address3: NSW; Address4: Australia 2086
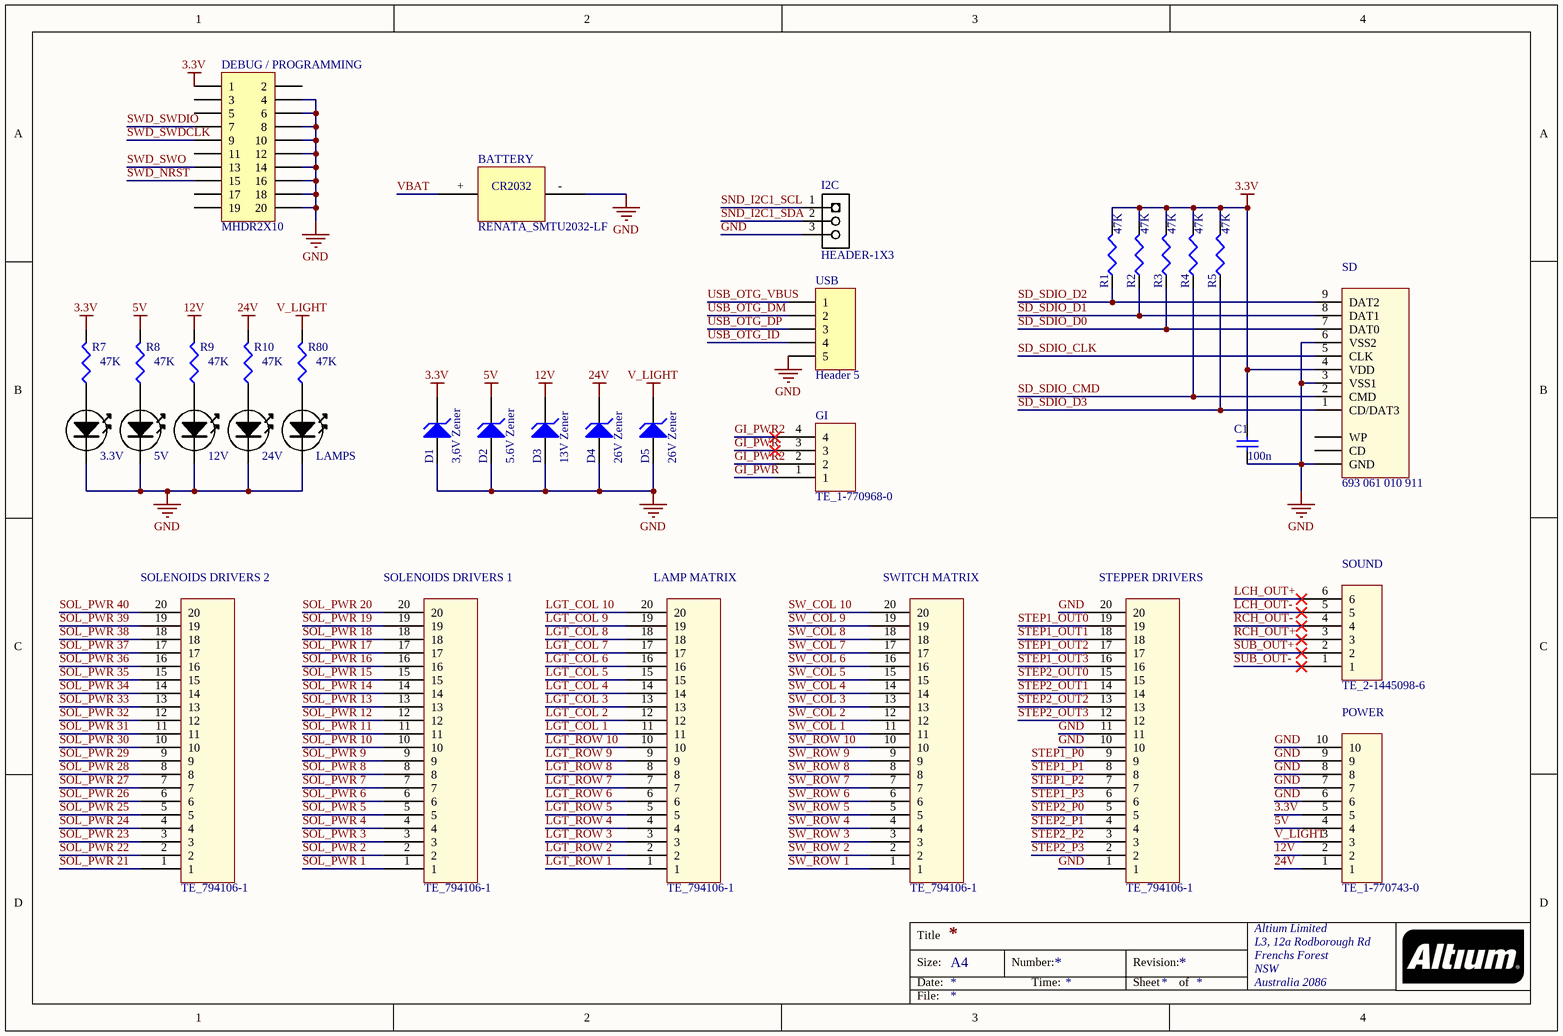
[diagram p3: Connectors.SchDoc]

### Parts
3.3V  LED-RED-3MM  [LED-3MM-RED]  (value not drawn)
5V  LED-RED-3MM  [LED-3MM-RED]  (value not drawn)
12V  LED-RED-3MM  [LED-3MM-RED]  (value not drawn)
24V  LED-RED-3MM  [LED-3MM-RED]  (value not drawn)
BATTERY  RENATA_SMTU2032-LF  [RENATA_SMTU2032-LF]
C1  value 100n  [0805C-GENERIC]  (hidden comment: Cap Semi)
D1  3,6V Zener  [DIODE-0.7]
D2  5.6V Zener  [DIODE-0.7]
D3  13V Zener  [DIODE-0.7]
D4  26V Zener  [DIODE-0.7]
D5  26V Zener  [DIODE-0.7]
DEBUG_/_PROGRAMMING  MHDR2X10  [IDC20-B]
GI  TE_1-770968-0  [TE_1-770968-0]
I2C  HEADER-1X3  [HEADER-1X3]
LAMP_MATRIX  TE_794106-1  [TE_794106-1]
LAMPS  LED-RED-3MM  [LED-3MM-RED]  (value not drawn)
POWER  TE_1-770743-0  [TE_1-770743-0]
R1  value 47K  [0805R-GENERIC]  (hidden comment: Res3)
R2  value 47K  [0805R-GENERIC]  (hidden comment: Res3)
R3  value 47K  [0805R-GENERIC]  (hidden comment: Res3)
R4  value 47K  [0805R-GENERIC]  (hidden comment: Res3)
R5  value 47K  [0805R-GENERIC]  (hidden comment: Res3)
R7  value 47K  [0805R-GENERIC]  (hidden comment: Res3)
R8  value 47K  [0805R-GENERIC]  (hidden comment: Res3)
R9  value 47K  [0805R-GENERIC]  (hidden comment: Res3)
R10  value 47K  [0805R-GENERIC]  (hidden comment: Res3)
R80  value 47K  [0805R-GENERIC]  (hidden comment: Res3)
SD  693 061 010 911  [693061010911]
SOLENOIDS_DRIVERS_1  TE_794106-1  [TE_794106-1]
SOLENOIDS_DRIVERS_2  TE_794106-1  [TE_794106-1]
SOUND  TE_2-1445098-6  [TE_2-1445098-6]
STEPPER_DRIVERS  TE_794106-1  [TE_794106-1]
SWITCH_MATRIX  TE_794106-1  [TE_794106-1]
USB  Header 5  [HEADER-1X5]

### Nets
3.3V: C1.2 D1.2(K) DEBUG_/_PROGRAMMING.1 POWER.5 R1.2 R2.2 R3.2 R4.2 R5.2 R7.2 SD.4(VDD)
5V: D2.2(K) POWER.4 R8.2
12V: D3.2(K) POWER.2 R9.2
24V: D4.2(K) POWER.1 R10.2
GND: 3.3V.K 5V.K 12V.K 24V.K BATTERY.- C1.1 D1.1(A) D2.1(A) D3.1(A) D4.1(A) D5.1(A) DEBUG_/_PROGRAMMING.4 DEBUG_/_PROGRAMMING.6 DEBUG_/_PROGRAMMING.8 DEBUG_/_PROGRAMMING.10 DEBUG_/_PROGRAMMING.12 DEBUG_/_PROGRAMMING.14 DEBUG_/_PROGRAMMING.16 DEBUG_/_PROGRAMMING.18 DEBUG_/_PROGRAMMING.20 I2C.3 LAMPS.K POWER.6 POWER.7 POWER.8 POWER.9 POWER.10 SD.3(VSS1) SD.6(VSS2) SD.GND STEPPER_DRIVERS.1 STEPPER_DRIVERS.10 STEPPER_DRIVERS.11 STEPPER_DRIVERS.20 USB.5
V_LIGHT: D5.2(K) POWER.3 R80.2
GI_PWR: GI.1 GI.3
GI_PWR2: GI.2 GI.4
LCH_OUT+: SOUND.6
LCH_OUT-: SOUND.5
LGT_COL 1: LAMP_MATRIX.11
LGT_COL 2: LAMP_MATRIX.12
LGT_COL 3: LAMP_MATRIX.13
LGT_COL 4: LAMP_MATRIX.14
LGT_COL 5: LAMP_MATRIX.15
LGT_COL 6: LAMP_MATRIX.16
LGT_COL 7: LAMP_MATRIX.17
LGT_COL 8: LAMP_MATRIX.18
LGT_COL 9: LAMP_MATRIX.19
LGT_COL 10: LAMP_MATRIX.20
LGT_ROW 1: LAMP_MATRIX.1
LGT_ROW 2: LAMP_MATRIX.2
LGT_ROW 3: LAMP_MATRIX.3
LGT_ROW 4: LAMP_MATRIX.4
LGT_ROW 5: LAMP_MATRIX.5
LGT_ROW 6: LAMP_MATRIX.6
LGT_ROW 7: LAMP_MATRIX.7
LGT_ROW 8: LAMP_MATRIX.8
LGT_ROW 9: LAMP_MATRIX.9
LGT_ROW 10: LAMP_MATRIX.10
RCH_OUT+: SOUND.3
RCH_OUT-: SOUND.4
SD_SDIO_CLK: SD.5(CLK)
SD_SDIO_CMD: R4.1 SD.2(CMD)
SD_SDIO_D0: R3.1 SD.7(DAT0)
SD_SDIO_D1: R2.1 SD.8(DAT1)
SD_SDIO_D2: R1.1 SD.9(DAT2)
SD_SDIO_D3: R5.1 SD.1(CD/DAT3)
SND_I2C1_SCL: I2C.1
SND_I2C1_SDA: I2C.2
SOL_PWR 1: SOLENOIDS_DRIVERS_1.1
SOL_PWR 2: SOLENOIDS_DRIVERS_1.2
SOL_PWR 3: SOLENOIDS_DRIVERS_1.3
SOL_PWR 4: SOLENOIDS_DRIVERS_1.4
SOL_PWR 5: SOLENOIDS_DRIVERS_1.5
SOL_PWR 6: SOLENOIDS_DRIVERS_1.6
SOL_PWR 7: SOLENOIDS_DRIVERS_1.7
SOL_PWR 8: SOLENOIDS_DRIVERS_1.8
SOL_PWR 9: SOLENOIDS_DRIVERS_1.9
SOL_PWR 10: SOLENOIDS_DRIVERS_1.10
SOL_PWR 11: SOLENOIDS_DRIVERS_1.11
SOL_PWR 12: SOLENOIDS_DRIVERS_1.12
SOL_PWR 13: SOLENOIDS_DRIVERS_1.13
SOL_PWR 14: SOLENOIDS_DRIVERS_1.14
SOL_PWR 15: SOLENOIDS_DRIVERS_1.15
SOL_PWR 16: SOLENOIDS_DRIVERS_1.16
SOL_PWR 17: SOLENOIDS_DRIVERS_1.17
SOL_PWR 18: SOLENOIDS_DRIVERS_1.18
SOL_PWR 19: SOLENOIDS_DRIVERS_1.19
SOL_PWR 20: SOLENOIDS_DRIVERS_1.20
SOL_PWR 21: SOLENOIDS_DRIVERS_2.1
SOL_PWR 22: SOLENOIDS_DRIVERS_2.2
SOL_PWR 23: SOLENOIDS_DRIVERS_2.3
SOL_PWR 24: SOLENOIDS_DRIVERS_2.4
SOL_PWR 25: SOLENOIDS_DRIVERS_2.5
SOL_PWR 26: SOLENOIDS_DRIVERS_2.6
SOL_PWR 27: SOLENOIDS_DRIVERS_2.7
SOL_PWR 28: SOLENOIDS_DRIVERS_2.8
SOL_PWR 29: SOLENOIDS_DRIVERS_2.9
SOL_PWR 30: SOLENOIDS_DRIVERS_2.10
SOL_PWR 31: SOLENOIDS_DRIVERS_2.11
SOL_PWR 32: SOLENOIDS_DRIVERS_2.12
SOL_PWR 33: SOLENOIDS_DRIVERS_2.13
SOL_PWR 34: SOLENOIDS_DRIVERS_2.14
SOL_PWR 35: SOLENOIDS_DRIVERS_2.15
SOL_PWR 36: SOLENOIDS_DRIVERS_2.16
SOL_PWR 37: SOLENOIDS_DRIVERS_2.17
SOL_PWR 38: SOLENOIDS_DRIVERS_2.18
SOL_PWR 39: SOLENOIDS_DRIVERS_2.19
SOL_PWR 40: SOLENOIDS_DRIVERS_2.20
STEP1_OUT0: STEPPER_DRIVERS.19
STEP1_OUT1: STEPPER_DRIVERS.18
STEP1_OUT2: STEPPER_DRIVERS.17
STEP1_OUT3: STEPPER_DRIVERS.16
STEP1_P0: STEPPER_DRIVERS.9
STEP1_P1: STEPPER_DRIVERS.8
STEP1_P2: STEPPER_DRIVERS.7
STEP1_P3: STEPPER_DRIVERS.6
STEP2_OUT0: STEPPER_DRIVERS.15
STEP2_OUT1: STEPPER_DRIVERS.14
STEP2_OUT2: STEPPER_DRIVERS.13
STEP2_OUT3: STEPPER_DRIVERS.12
STEP2_P0: STEPPER_DRIVERS.5
STEP2_P1: STEPPER_DRIVERS.4
STEP2_P2: STEPPER_DRIVERS.3
STEP2_P3: STEPPER_DRIVERS.2
SUB_OUT+: SOUND.2
SUB_OUT-: SOUND.1
SW_COL 1: SWITCH_MATRIX.11
SW_COL 2: SWITCH_MATRIX.12
SW_COL 3: SWITCH_MATRIX.13
SW_COL 4: SWITCH_MATRIX.14
SW_COL 5: SWITCH_MATRIX.15
SW_COL 6: SWITCH_MATRIX.16
SW_COL 7: SWITCH_MATRIX.17
SW_COL 8: SWITCH_MATRIX.18
SW_COL 9: SWITCH_MATRIX.19
SW_COL 10: SWITCH_MATRIX.20
SW_ROW 1: SWITCH_MATRIX.1
SW_ROW 2: SWITCH_MATRIX.2
SW_ROW 3: SWITCH_MATRIX.3
SW_ROW 4: SWITCH_MATRIX.4
SW_ROW 5: SWITCH_MATRIX.5
SW_ROW 6: SWITCH_MATRIX.6
SW_ROW 7: SWITCH_MATRIX.7
SW_ROW 8: SWITCH_MATRIX.8
SW_ROW 9: SWITCH_MATRIX.9
SW_ROW 10: SWITCH_MATRIX.10
SWD_NRST: DEBUG_/_PROGRAMMING.15
SWD_SWDCLK: DEBUG_/_PROGRAMMING.9
SWD_SWDIO: DEBUG_/_PROGRAMMING.7
SWD_SWO: DEBUG_/_PROGRAMMING.13
USB_OTG_DM: USB.2
USB_OTG_DP: USB.3
USB_OTG_ID: USB.4
USB_OTG_VBUS: USB.1
VBAT: BATTERY.+
Net3.3V_A: 3.3V.A R7.1
Net5V_A: 5V.A R8.1
Net12V_A: 12V.A R9.1
Net24V_A: 24V.A R10.1
NetLAMPS_A: LAMPS.A R80.1

Not connected (* = marked no-connect by the designer): DEBUG_/_PROGRAMMING 2 3 5 11 17 19; SD CD WP

### Notes on the sheet
- Title
- Size:
- Date:
- A4
- Number:
- Time:
- Revision:
- Sheet
- of
- File:
- (in symbol RENATA_SMTU2032-LF) CR2032

### Library data of the parts
C1 = Cap Semi: Capacitor (Semiconductor SIM Model); Published: 8-Jun-2000; LatestRevisionDate: 29-May-2009; LatestRevisionNote: IPC-7351 Footprint Added.; PackageReference: C1206; Publisher: Altium Limited; PackageDescription: Chip Capacitor
D1-D5 = D Zener: Zener Diode; Published: 8-Jun-2000; LatestRevisionDate: 17-Jul-2002; LatestRevisionNote: Re-released for DXP Platform.; PackageReference: DIODE-0.7; Publisher: Altium Limited; PackageDescription: Diode, Thru-Hole; 2 Leads; 0.7 in Pin Spacing
DEBUG_/_PROGRAMMING = MHDR2X10: Header, 10-Pin, Dual row; LatestRevisionDate: 17-Jul-2002; LatestRevisionNote: Re-released for DXP Platform.; Publisher: Altium Limited
R1-R5 R7-R10 R80 = Res3: Resistor; Published: 8-Jun-2000; LatestRevisionDate: 29-May-2009; LatestRevisionNote: IPC-7351 Footprint Added.; PackageReference: J1-0603; Publisher: Altium Limited; PackageDescription: Chip Resistor
SD = 503500-0991: SD Card Connector - Push & Push - With Card Detection / 9 pins; MF: Molex; MP: 503500-0991; Price: 2.91 USD; Package: FakePackage u; Availability: Good; Value: *
USB = Header 5: Header, 5-Pin; LatestRevisionDate: 17-Jul-2002; LatestRevisionNote: Re-released for DXP Platform.; Publisher: Altium Limited
I2C = HEADER-1X3: Supplier 1: Digi-Key; Supplier Part Number 1: S1011E-36-ND

## Sheet Stepper Motor Driver.SchDoc
size A4
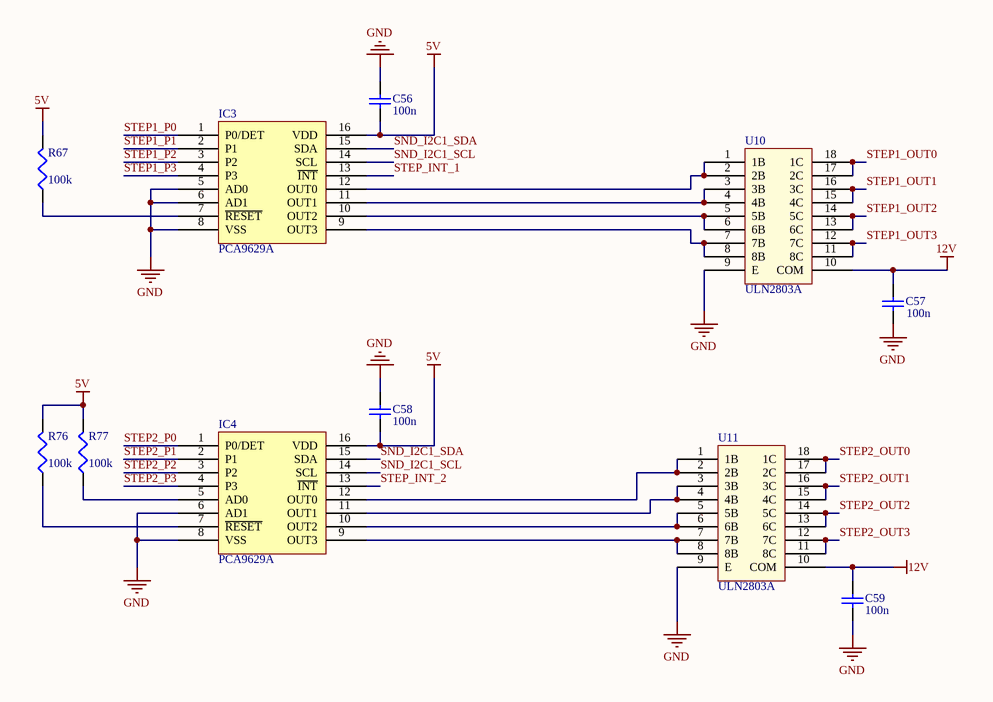
[diagram p4: Stepper Motor Driver.SchDoc]

### Parts
C56  value 100n  [0805C-GENERIC]  (hidden comment: Cap Semi)
C57  value 100n  [0805C-GENERIC]  (hidden comment: Cap Semi)
C58  value 100n  [0805C-GENERIC]  (hidden comment: Cap Semi)
C59  value 100n  [0805C-GENERIC]  (hidden comment: Cap Semi)
IC3  PCA9629A  [TSSOP16]
IC4  PCA9629A  [TSSOP16]
R67  value 100k  [0805R-GENERIC]  (hidden comment: Res3)
R76  value 100k  [0805R-GENERIC]  (hidden comment: Res3)
R77  value 100k  [0805R-GENERIC]  (hidden comment: Res3)
U10  ULN2803A  [SOIC18]
U11  ULN2803A  [SOIC18]

### Nets
5V: C56.1 C58.1 IC3.16(VDD) IC4.16(VDD) R67.2 R76.2 R77.2
12V: C57.2 C59.2 U10.10(COM) U11.10(COM)
GND: C56.2 C57.1 C58.2 C59.1 IC3.5(AD0) IC3.6(AD1) IC3.8(VSS) IC4.6(AD1) IC4.8(VSS) U10.9(E) U11.9(E)
SND_I2C1_SCL: IC3.14(SCL) IC4.14(SCL)
SND_I2C1_SDA: IC3.15(SDA) IC4.15(SDA)
STEP1_OUT0: U10.17(2C) U10.18(1C)
STEP1_OUT1: U10.15(4C) U10.16(3C)
STEP1_OUT2: U10.13(6C) U10.14(5C)
STEP1_OUT3: U10.11(8C) U10.12(7C)
STEP1_P0: IC3.1(P0/DET)
STEP1_P1: IC3.2(P1)
STEP1_P2: IC3.3(P2)
STEP1_P3: IC3.4(P3)
STEP2_OUT0: U11.17(2C) U11.18(1C)
STEP2_OUT1: U11.15(4C) U11.16(3C)
STEP2_OUT2: U11.13(6C) U11.14(5C)
STEP2_OUT3: U11.11(8C) U11.12(7C)
STEP2_P0: IC4.1(P0/DET)
STEP2_P1: IC4.2(P1)
STEP2_P2: IC4.3(P2)
STEP2_P3: IC4.4(P3)
STEP_INT_1: IC3.13(~{INT})
STEP_INT_2: IC4.13(~{INT})
NetIC3_7: IC3.7(~{RESET}) R67.1
NetIC3_9: IC3.9(OUT3) U10.7(7B) U10.8(8B)
NetIC3_10: IC3.10(OUT2) U10.5(5B) U10.6(6B)
NetIC3_11: IC3.11(OUT1) U10.3(3B) U10.4(4B)
NetIC3_12: IC3.12(OUT0) U10.1(1B) U10.2(2B)
NetIC4_5: IC4.5(AD0) R77.1
NetIC4_7: IC4.7(~{RESET}) R76.1
NetIC4_9: IC4.9(OUT3) U11.7(7B) U11.8(8B)
NetIC4_10: IC4.10(OUT2) U11.5(5B) U11.6(6B)
NetIC4_11: IC4.11(OUT1) U11.3(3B) U11.4(4B)
NetIC4_12: IC4.12(OUT0) U11.1(1B) U11.2(2B)

### Library data of the parts
C56-C59 = Cap Semi: Capacitor (Semiconductor SIM Model); Published: 8-Jun-2000; LatestRevisionDate: 29-May-2009; LatestRevisionNote: IPC-7351 Footprint Added.; PackageReference: C1206; Publisher: Altium Limited; PackageDescription: Chip Capacitor
IC3 IC4 = PCA9629A: Fm+ I2C-bus advanced stepper motor controller
R67 R76 R77 = Res3: Resistor; Published: 8-Jun-2000; LatestRevisionDate: 29-May-2009; LatestRevisionNote: IPC-7351 Footprint Added.; PackageReference: J1-0603; Publisher: Altium Limited; PackageDescription: Chip Resistor

## Sheet Switch Matrix Driver.SchDoc
size A4; Organization: Altium Limited; Address1: L3, 12a Rodborough Rd; Address2: Frenchs Forest; Address3: NSW; Address4: Australia 2086
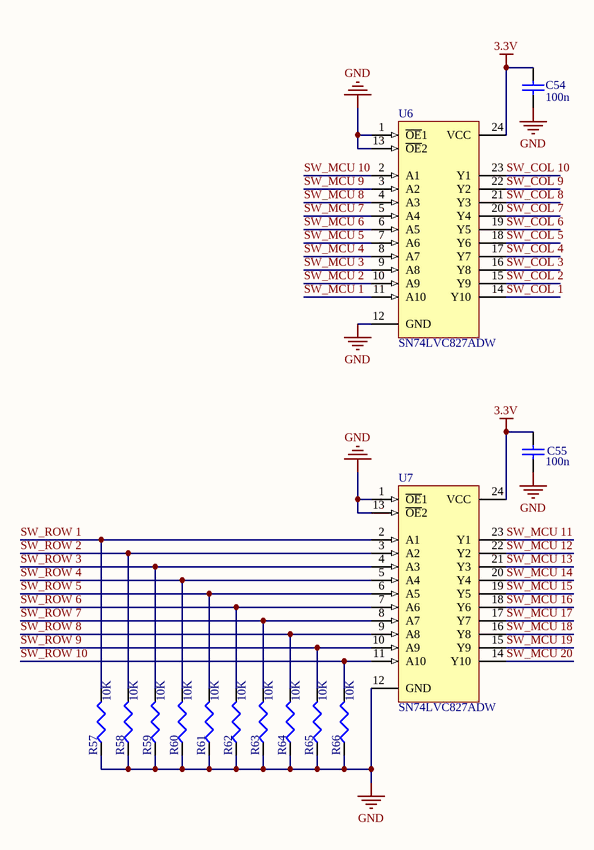
[diagram p5: Switch Matrix Driver.SchDoc]

### Parts
C54  value 100n  [0805C-GENERIC]  (hidden comment: Cap Semi)
C55  value 100n  [0805C-GENERIC]  (hidden comment: Cap Semi)
R57  value 10K  [0805R-GENERIC]  (hidden comment: Res3)
R58  value 10K  [0805R-GENERIC]  (hidden comment: Res3)
R59  value 10K  [0805R-GENERIC]  (hidden comment: Res3)
R60  value 10K  [0805R-GENERIC]  (hidden comment: Res3)
R61  value 10K  [0805R-GENERIC]  (hidden comment: Res3)
R62  value 10K  [0805R-GENERIC]  (hidden comment: Res3)
R63  value 10K  [0805R-GENERIC]  (hidden comment: Res3)
R64  value 10K  [0805R-GENERIC]  (hidden comment: Res3)
R65  value 10K  [0805R-GENERIC]  (hidden comment: Res3)
R66  value 10K  [0805R-GENERIC]  (hidden comment: Res3)
U6  SN74LVC827ADW  [SOIC24]
U7  SN74LVC827ADW  [SOIC24]

### Nets
3.3V: C54.2 C55.2 U6.24(VCC) U7.24(VCC)
GND: C54.1 C55.1 R57.1 R58.1 R59.1 R60.1 R61.1 R62.1 R63.1 R64.1 R65.1 R66.1 U6.1(~{OE}1) U6.12(GND) U6.13(~{OE}2) U7.1(~{OE}1) U7.12(GND) U7.13(~{OE}2)
SW_COL 1: U6.14(Y10)
SW_COL 2: U6.15(Y9)
SW_COL 3: U6.16(Y8)
SW_COL 4: U6.17(Y7)
SW_COL 5: U6.18(Y6)
SW_COL 6: U6.19(Y5)
SW_COL 7: U6.20(Y4)
SW_COL 8: U6.21(Y3)
SW_COL 9: U6.22(Y2)
SW_COL 10: U6.23(Y1)
SW_MCU 1: U6.11(A10)
SW_MCU 2: U6.10(A9)
SW_MCU 3: U6.9(A8)
SW_MCU 4: U6.8(A7)
SW_MCU 5: U6.7(A6)
SW_MCU 6: U6.6(A5)
SW_MCU 7: U6.5(A4)
SW_MCU 8: U6.4(A3)
SW_MCU 9: U6.3(A2)
SW_MCU 10: U6.2(A1)
SW_MCU 11: U7.23(Y1)
SW_MCU 12: U7.22(Y2)
SW_MCU 13: U7.21(Y3)
SW_MCU 14: U7.20(Y4)
SW_MCU 15: U7.19(Y5)
SW_MCU 16: U7.18(Y6)
SW_MCU 17: U7.17(Y7)
SW_MCU 18: U7.16(Y8)
SW_MCU 19: U7.15(Y9)
SW_MCU 20: U7.14(Y10)
SW_ROW 1: R57.2 U7.2(A1)
SW_ROW 2: R58.2 U7.3(A2)
SW_ROW 3: R59.2 U7.4(A3)
SW_ROW 4: R60.2 U7.5(A4)
SW_ROW 5: R61.2 U7.6(A5)
SW_ROW 6: R62.2 U7.7(A6)
SW_ROW 7: R63.2 U7.8(A7)
SW_ROW 8: R64.2 U7.9(A8)
SW_ROW 9: R65.2 U7.10(A9)
SW_ROW 10: R66.2 U7.11(A10)

### Notes on the sheet
- Title
- Size:
- Date:
- A4
- Number:
- Time:
- Revision:
- Sheet
- of
- File:

### Library data of the parts
C54 C55 = Cap Semi: Capacitor (Semiconductor SIM Model); Published: 8-Jun-2000; LatestRevisionDate: 29-May-2009; LatestRevisionNote: IPC-7351 Footprint Added.; PackageReference: C1206; Publisher: Altium Limited; PackageDescription: Chip Capacitor
R57-R66 = Res3: Resistor; Published: 8-Jun-2000; LatestRevisionDate: 29-May-2009; LatestRevisionNote: IPC-7351 Footprint Added.; PackageReference: J1-0603; Publisher: Altium Limited; PackageDescription: Chip Resistor
U6 U7 = SN74LVC827ADW: as U2 on sheet Solenoid and Flasher Driver; Published: 8-Jun-2000; LatestRevisionDate: 13-Apr-2006; LatestRevisionNote: IPC-7351 Footprint Added.; DatasheetVersion: Jun-1998; PackageVersion: Mar-2000; PackageReference: DW024; Publisher: Altium Limited; PackageDescription: 24-Pin Plastic Small Outline Integrated Circuit 1.27 mm Pitch; Code_JEDEC: MS-013; ComponentLink1Description: Manufacturer Link; ComponentLink1URL: http://www.ti.com/; ComponentLink2Description: Datasheet; ComponentLink2URL: http://www-s.ti.com/sc/ds/sn74lvc827a.pdf

## Sheet Lamp Matrix and GI Driver.SchDoc
size A3 portrait; Organization: Altium Limited; Address1: L3, 12a Rodborough Rd; Address2: Frenchs Forest; Address3: NSW; Address4: Australia 2086
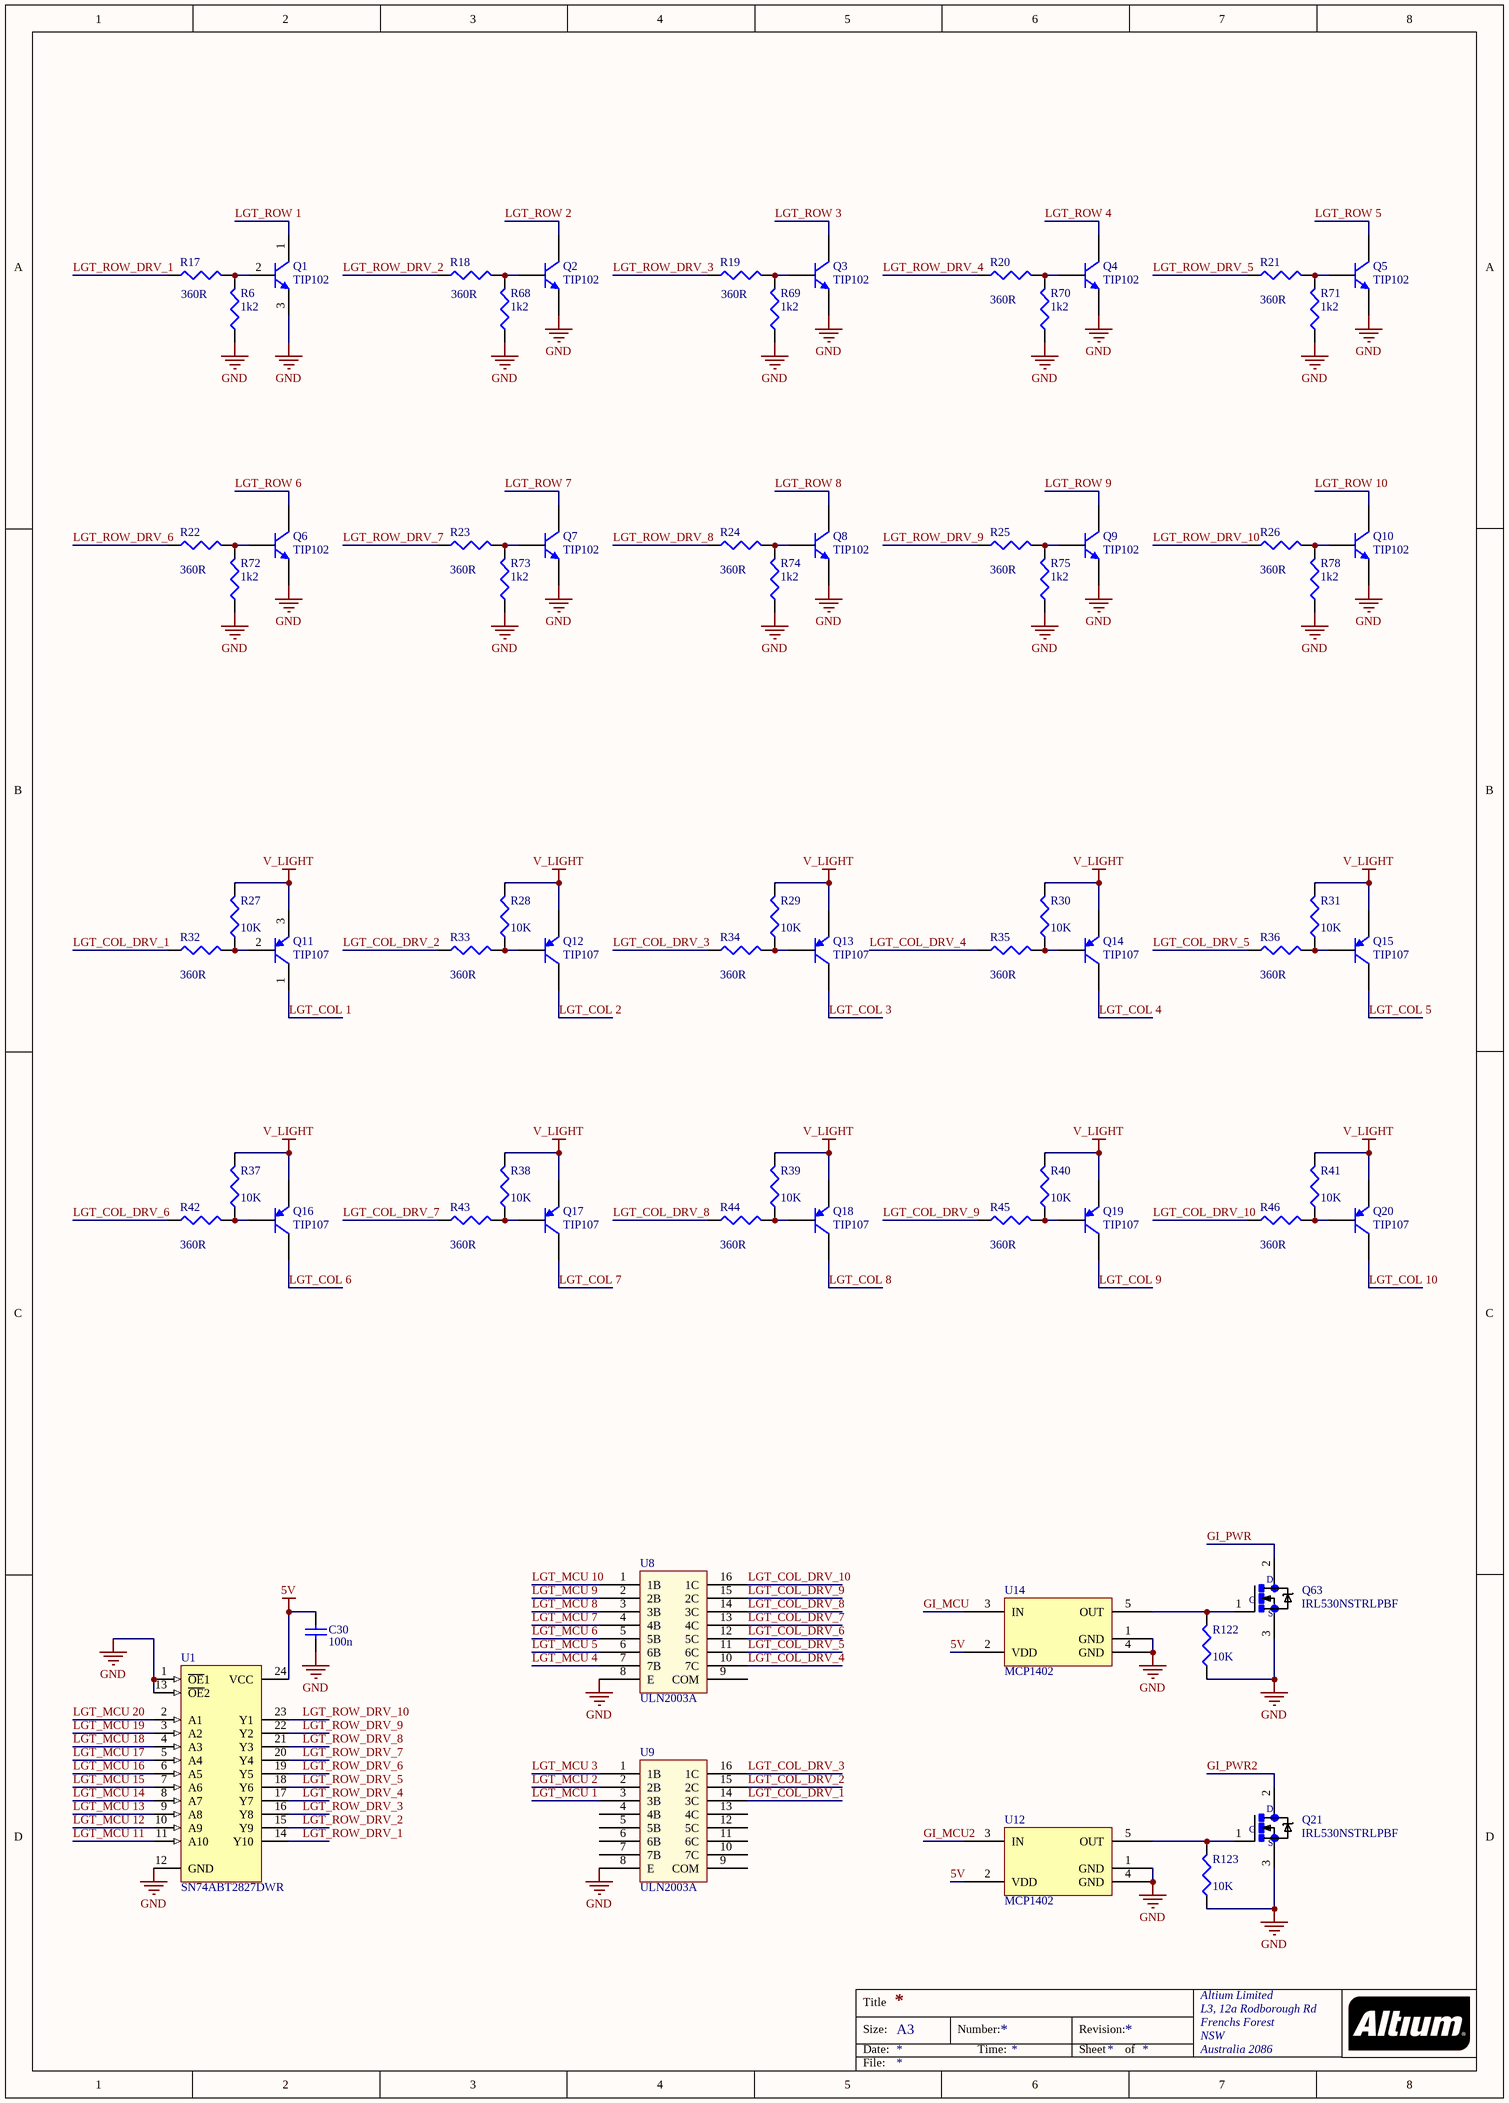
[diagram p6: Lamp Matrix and GI Driver.SchDoc]

### Parts
C30  value 100n  [0805C-GENERIC]  (hidden comment: Cap Semi)
Q1  TIP102  [TO-220AB]
Q2  TIP102  [TO-220AB]
Q3  TIP102  [TO-220AB]
Q4  TIP102  [TO-220AB]
Q5  TIP102  [TO-220AB]
Q6  TIP102  [TO-220AB]
Q7  TIP102  [TO-220AB]
Q8  TIP102  [TO-220AB]
Q9  TIP102  [TO-220AB]
Q10  TIP102  [TO-220AB]
Q11  TIP107  [TO-220AB]
Q12  TIP107  [TO-220AB]
Q13  TIP107  [TO-220AB]
Q14  TIP107  [TO-220AB]
Q15  TIP107  [TO-220AB]
Q16  TIP107  [TO-220AB]
Q17  TIP107  [TO-220AB]
Q18  TIP107  [TO-220AB]
Q19  TIP107  [TO-220AB]
Q20  TIP107  [TO-220AB]
Q21  IRL530NSTRLPBF  [TO-220AB]
Q63  IRL530NSTRLPBF  [TO-220AB]
R6  value 1k2  [0805R-GENERIC]  (hidden comment: Res3)
R17  value 360R  [0805R-GENERIC]  (hidden comment: Res3)
R18  value 360R  [0805R-GENERIC]  (hidden comment: Res3)
R19  value 360R  [0805R-GENERIC]  (hidden comment: Res3)
R20  value 360R  [0805R-GENERIC]  (hidden comment: Res3)
R21  value 360R  [0805R-GENERIC]  (hidden comment: Res3)
R22  value 360R  [0805R-GENERIC]  (hidden comment: Res3)
R23  value 360R  [0805R-GENERIC]  (hidden comment: Res3)
R24  value 360R  [0805R-GENERIC]  (hidden comment: Res3)
R25  value 360R  [0805R-GENERIC]  (hidden comment: Res3)
R26  value 360R  [0805R-GENERIC]  (hidden comment: Res3)
R27  value 10K  [0805R-GENERIC]  (hidden comment: Res3)
R28  value 10K  [0805R-GENERIC]  (hidden comment: Res3)
R29  value 10K  [0805R-GENERIC]  (hidden comment: Res3)
R30  value 10K  [0805R-GENERIC]  (hidden comment: Res3)
R31  value 10K  [0805R-GENERIC]  (hidden comment: Res3)
R32  value 360R  [0805R-GENERIC]  (hidden comment: Res3)
R33  value 360R  [0805R-GENERIC]  (hidden comment: Res3)
R34  value 360R  [0805R-GENERIC]  (hidden comment: Res3)
R35  value 360R  [0805R-GENERIC]  (hidden comment: Res3)
R36  value 360R  [0805R-GENERIC]  (hidden comment: Res3)
R37  value 10K  [0805R-GENERIC]  (hidden comment: Res3)
R38  value 10K  [0805R-GENERIC]  (hidden comment: Res3)
R39  value 10K  [0805R-GENERIC]  (hidden comment: Res3)
R40  value 10K  [0805R-GENERIC]  (hidden comment: Res3)
R41  value 10K  [0805R-GENERIC]  (hidden comment: Res3)
R42  value 360R  [0805R-GENERIC]  (hidden comment: Res3)
R43  value 360R  [0805R-GENERIC]  (hidden comment: Res3)
R44  value 360R  [0805R-GENERIC]  (hidden comment: Res3)
R45  value 360R  [0805R-GENERIC]  (hidden comment: Res3)
R46  value 360R  [0805R-GENERIC]  (hidden comment: Res3)
R68  value 1k2  [0805R-GENERIC]  (hidden comment: Res3)
R69  value 1k2  [0805R-GENERIC]  (hidden comment: Res3)
R70  value 1k2  [0805R-GENERIC]  (hidden comment: Res3)
R71  value 1k2  [0805R-GENERIC]  (hidden comment: Res3)
R72  value 1k2  [0805R-GENERIC]  (hidden comment: Res3)
R73  value 1k2  [0805R-GENERIC]  (hidden comment: Res3)
R74  value 1k2  [0805R-GENERIC]  (hidden comment: Res3)
R75  value 1k2  [0805R-GENERIC]  (hidden comment: Res3)
R78  value 1k2  [0805R-GENERIC]  (hidden comment: Res3)
R122  value 10K  [0805R-GENERIC]  (hidden comment: Res3)
R123  value 10K  [0805R-GENERIC]  (hidden comment: Res3)
U1  SN74ABT2827DWR  [SOIC24]
U8  ULN2003A  [SOIC16]
U9  ULN2003A  [SOIC16]
U12  MCP1402  [SOT23-5]
U14  MCP1402  [SOT23-5]

### Nets
5V: C30.2 U1.24(VCC) U12.2(VDD) U14.2(VDD)
GND: C30.1 Q1.3(E) Q2.3(E) Q3.3(E) Q4.3(E) Q5.3(E) Q6.3(E) Q7.3(E) Q8.3(E) Q9.3(E) Q10.3(E) Q21.3(S) Q63.3(S) R6.1 R68.1 R69.1 R70.1 R71.1 R72.1 R73.1 R74.1 R75.1 R78.1 R122.1 R123.1 U1.1(~{OE}1) U1.12(GND) U1.13(~{OE}2) U8.8(E) U9.8(E) U12.1(GND) U12.4(GND) U14.1(GND) U14.4(GND)
V_LIGHT: Q11.3(E) Q12.3(E) Q13.3(E) Q14.3(E) Q15.3(E) Q16.3(E) Q17.3(E) Q18.3(E) Q19.3(E) Q20.3(E) R27.2 R28.2 R29.2 R30.2 R31.2 R37.2 R38.2 R39.2 R40.2 R41.2
GI_MCU: U14.3(IN)
GI_MCU2: U12.3(IN)
GI_PWR: Q63.2(D)
GI_PWR2: Q21.2(D)
LGT_COL 1: Q11.1(C)
LGT_COL 2: Q12.1(C)
LGT_COL 3: Q13.1(C)
LGT_COL 4: Q14.1(C)
LGT_COL 5: Q15.1(C)
LGT_COL 6: Q16.1(C)
LGT_COL 7: Q17.1(C)
LGT_COL 8: Q18.1(C)
LGT_COL 9: Q19.1(C)
LGT_COL 10: Q20.1(C)
LGT_COL_DRV_1: R32.1 U9.14(3C)
LGT_COL_DRV_2: R33.1 U9.15(2C)
LGT_COL_DRV_3: R34.1 U9.16(1C)
LGT_COL_DRV_4: R35.1 U8.10(7C)
LGT_COL_DRV_5: R36.1 U8.11(6C)
LGT_COL_DRV_6: R42.1 U8.12(5C)
LGT_COL_DRV_7: R43.1 U8.13(4C)
LGT_COL_DRV_8: R44.1 U8.14(3C)
LGT_COL_DRV_9: R45.1 U8.15(2C)
LGT_COL_DRV_10: R46.1 U8.16(1C)
LGT_MCU 1: U9.3(3B)
LGT_MCU 2: U9.2(2B)
LGT_MCU 3: U9.1(1B)
LGT_MCU 4: U8.7(7B)
LGT_MCU 5: U8.6(6B)
LGT_MCU 6: U8.5(5B)
LGT_MCU 7: U8.4(4B)
LGT_MCU 8: U8.3(3B)
LGT_MCU 9: U8.2(2B)
LGT_MCU 10: U8.1(1B)
LGT_MCU 11: U1.11(A10)
LGT_MCU 12: U1.10(A9)
LGT_MCU 13: U1.9(A8)
LGT_MCU 14: U1.8(A7)
LGT_MCU 15: U1.7(A6)
LGT_MCU 16: U1.6(A5)
LGT_MCU 17: U1.5(A4)
LGT_MCU 18: U1.4(A3)
LGT_MCU 19: U1.3(A2)
LGT_MCU 20: U1.2(A1)
LGT_ROW 1: Q1.1(C)
LGT_ROW 2: Q2.1(C)
LGT_ROW 3: Q3.1(C)
LGT_ROW 4: Q4.1(C)
LGT_ROW 5: Q5.1(C)
LGT_ROW 6: Q6.1(C)
LGT_ROW 7: Q7.1(C)
LGT_ROW 8: Q8.1(C)
LGT_ROW 9: Q9.1(C)
LGT_ROW 10: Q10.1(C)
LGT_ROW_DRV_1: R17.1 U1.14(Y10)
LGT_ROW_DRV_2: R18.1 U1.15(Y9)
LGT_ROW_DRV_3: R19.1 U1.16(Y8)
LGT_ROW_DRV_4: R20.1 U1.17(Y7)
LGT_ROW_DRV_5: R21.1 U1.18(Y6)
LGT_ROW_DRV_6: R22.1 U1.19(Y5)
LGT_ROW_DRV_7: R23.1 U1.20(Y4)
LGT_ROW_DRV_8: R24.1 U1.21(Y3)
LGT_ROW_DRV_9: R25.1 U1.22(Y2)
LGT_ROW_DRV_10: R26.1 U1.23(Y1)
NetQ1_2: Q1.2(B) R6.2 R17.2
NetQ2_2: Q2.2(B) R18.2 R68.2
NetQ3_2: Q3.2(B) R19.2 R69.2
NetQ4_2: Q4.2(B) R20.2 R70.2
NetQ5_2: Q5.2(B) R21.2 R71.2
NetQ6_2: Q6.2(B) R22.2 R72.2
NetQ7_2: Q7.2(B) R23.2 R73.2
NetQ8_2: Q8.2(B) R24.2 R74.2
NetQ9_2: Q9.2(B) R25.2 R75.2
NetQ10_2: Q10.2(B) R26.2 R78.2
NetQ11_2: Q11.2(B) R27.1 R32.2
NetQ12_2: Q12.2(B) R28.1 R33.2
NetQ13_2: Q13.2(B) R29.1 R34.2
NetQ14_2: Q14.2(B) R30.1 R35.2
NetQ15_2: Q15.2(B) R31.1 R36.2
NetQ16_2: Q16.2(B) R37.1 R42.2
NetQ17_2: Q17.2(B) R38.1 R43.2
NetQ18_2: Q18.2(B) R39.1 R44.2
NetQ19_2: Q19.2(B) R40.1 R45.2
NetQ20_2: Q20.2(B) R41.1 R46.2
NetQ21_1: Q21.1(G) R123.2 U12.5(OUT)
NetQ63_1: Q63.1(G) R122.2 U14.5(OUT)

Not connected (* = marked no-connect by the designer): U8 9(COM); U9 4(4B) 5(5B) 6(6B) 7(7B) 9(COM) 10(7C) 11(6C) 12(5C) 13(4C)

### Notes on the sheet
- Title
- Size:
- Date:
- A3
- Number:
- Time:
- Revision:
- Sheet
- of
- File:

### Library data of the parts
C30 = Cap Semi: Capacitor (Semiconductor SIM Model); Published: 8-Jun-2000; LatestRevisionDate: 29-May-2009; LatestRevisionNote: IPC-7351 Footprint Added.; PackageReference: C1206; Publisher: Altium Limited; PackageDescription: Chip Capacitor
Q1-Q10 = NPN: NPN Bipolar Transistor; pin to pad: 1>2 2>1; Published: 8-Jun-2000; LatestRevisionDate: 17-Jul-2002; LatestRevisionNote: Re-released for DXP Platform.; PackageReference: TO-226-AA; Publisher: Altium Limited; PackageDescription: TO, Flat Index; 3 In-Line, Axial Leads; Body Dia. 4.8mm; Leads 0.55 x 0.51 mm (max); Code_JEDEC: TO-226-AA
Q11-Q20 = PNP: PNP Bipolar Transistor; pin to pad: 1>2 2>1; Published: 8-Jun-2000; LatestRevisionDate: 29-May-2009; LatestRevisionNote: IPC-7351 Footprint Added.; PackageVersion: Aug-1999; PackageReference: SOT-23B; Publisher: Altium Limited; PackageDescription: 3-Pin SOT-23 Package 0.95 mm Pitch, 2.4 mm Lead Span
Q21 Q63 = IRL530NSTRLPBF: MOSFET N-CH 100V 17A D2PAK; MF: Infineon; Price: 0.79 USD; Package: D2PAK Infineon; Availability: Good; MP: IRL530NSTRLPBF; Value: *
R6 R17-R46 R68-R75 R78 R122 R123 = Res3: Resistor; Published: 8-Jun-2000; LatestRevisionDate: 29-May-2009; LatestRevisionNote: IPC-7351 Footprint Added.; PackageReference: J1-0603; Publisher: Altium Limited; PackageDescription: Chip Resistor
U1 = SN74LVC827ADW: as U2 on sheet Solenoid and Flasher Driver; Published: 8-Jun-2000; LatestRevisionDate: 13-Apr-2006; LatestRevisionNote: IPC-7351 Footprint Added.; DatasheetVersion: Jun-1998; PackageVersion: Mar-2000; PackageReference: DW024; Publisher: Altium Limited; PackageDescription: 24-Pin Plastic Small Outline Integrated Circuit 1.27 mm Pitch; Code_JEDEC: MS-013; ComponentLink1Description: Manufacturer Link; ComponentLink1URL: http://www.ti.com/; ComponentLink2Description: Datasheet; ComponentLink2URL: http://www-s.ti.com/sc/ds/sn74lvc827a.pdf

## Sheet Digital Audio Amp.SchDoc
size A4; Organization: Altium Limited; Address1: L3, 12a Rodborough Rd; Address2: Frenchs Forest; Address3: NSW; Address4: Australia 2086
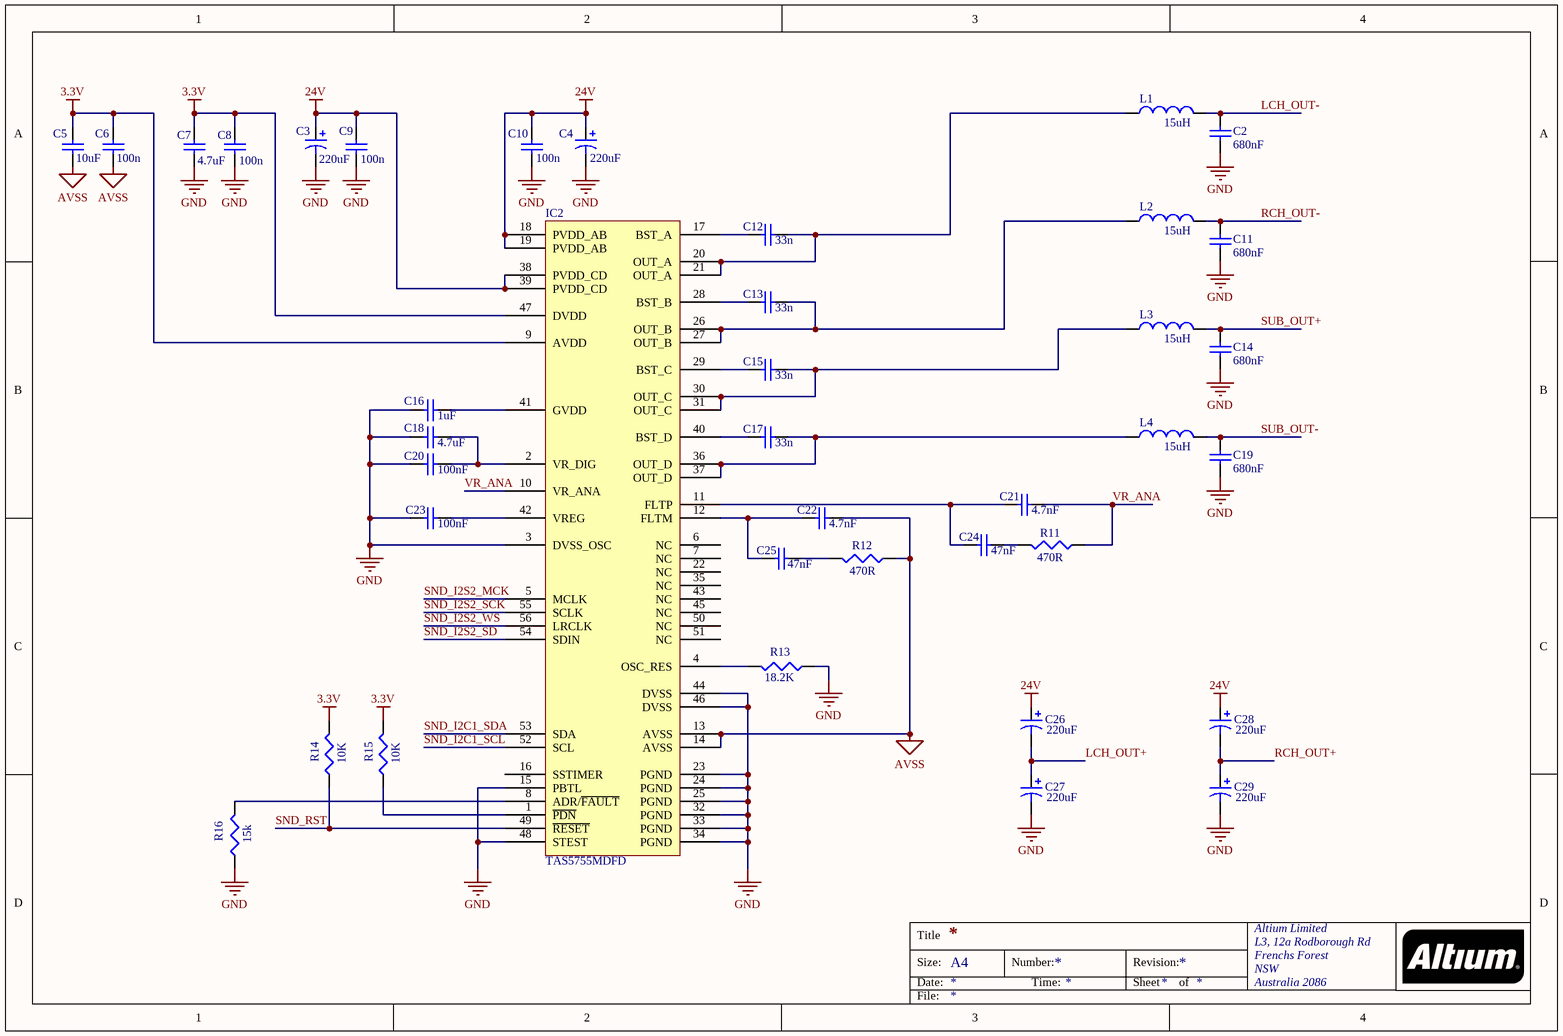
[diagram p7: Digital Audio Amp.SchDoc]

### Parts
C2  value 680nF  [1206C-GENERIC]  (hidden comment: Cap Semi)
C3  value 220uF  [PANACAP-F-GENERIC]  (hidden comment: Cap Pol3)
C4  value 220uF  [PANACAP-F-GENERIC]  (hidden comment: Cap Pol3)
C5  value 10uF  [0805C-GENERIC]  (hidden comment: Cap Semi)
C6  value 100n  [0805C-GENERIC]  (hidden comment: Cap Semi)
C7  value 4.7uF  [0805C-GENERIC]  (hidden comment: Cap Semi)
C8  value 100n  [0805C-GENERIC]  (hidden comment: Cap Semi)
C9  value 100n  [0805C-GENERIC]  (hidden comment: Cap Semi)
C10  value 100n  [0805C-GENERIC]  (hidden comment: Cap Semi)
C11  value 680nF  [1206C-GENERIC]  (hidden comment: Cap Semi)
C12  value 33n  [1206C-GENERIC]  (hidden comment: Cap Semi)
C13  value 33n  [1206C-GENERIC]  (hidden comment: Cap Semi)
C14  value 680nF  [1206C-GENERIC]  (hidden comment: Cap Semi)
C15  value 33n  [1206C-GENERIC]  (hidden comment: Cap Semi)
C16  value 1uF  [0805C-GENERIC]  (hidden comment: Cap Semi)
C17  value 33n  [1206C-GENERIC]  (hidden comment: Cap Semi)
C18  value 4.7uF  [0805C-GENERIC]  (hidden comment: Cap Semi)
C19  value 680nF  [1206C-GENERIC]  (hidden comment: Cap Semi)
C20  value 100nF  [0805C-GENERIC]  (hidden comment: Cap Semi)
C21  value 4.7nF  [0805C-GENERIC]  (hidden comment: Cap Semi)
C22  value 4.7nF  [0805C-GENERIC]  (hidden comment: Cap Semi)
C23  value 100nF  [0805C-GENERIC]  (hidden comment: Cap Semi)
C24  value 47nF  [0805C-GENERIC]  (hidden comment: Cap Semi)
C25  value 47nF  [0805C-GENERIC]  (hidden comment: Cap Semi)
C26  value 220uF  [PANACAP-F-GENERIC]  (hidden comment: Cap Pol3)
C27  value 220uF  [PANACAP-F-GENERIC]  (hidden comment: Cap Pol3)
C28  value 220uF  [PANACAP-F-GENERIC]  (hidden comment: Cap Pol3)
C29  value 220uF  [PANACAP-F-GENERIC]  (hidden comment: Cap Pol3)
IC2  TAS5755MDFD  [DFD (R-PDSO-G56)]
L1  value 15uH  [7447709150]  (hidden comment: Inductor)
L2  value 15uH  [7447709150]  (hidden comment: Inductor)
L3  value 15uH  [7447709150]  (hidden comment: Inductor)
L4  value 15uH  [7447709150]  (hidden comment: Inductor)
R11  value 470R  [0805R-GENERIC]  (hidden comment: Res3)
R12  value 470R  [0805R-GENERIC]  (hidden comment: Res3)
R13  value 18.2K  [0805R-GENERIC]  (hidden comment: Res3)
R14  value 10K  [0805R-GENERIC]  (hidden comment: Res3)
R15  value 10K  [0805R-GENERIC]  (hidden comment: Res3)
R16  value 15k  [0805R-GENERIC]  (hidden comment: Res3)

### Nets
3.3V: C5.1 C6.2 C7.2 C8.2 IC2.9(AVDD) IC2.47(DVDD) R14.2 R15.2
24V: C3.1 C4.1 C9.2 C10.2 C26.1 C28.1 IC2.18(PVDD_AB) IC2.19(PVDD_AB) IC2.38(PVDD_CD) IC2.39(PVDD_CD)
AVSS: C5.2 C6.1 C22.1 IC2.13(AVSS) IC2.14(AVSS) R12.1
GND: C2.2 C3.2 C4.2 C7.1 C8.1 C9.1 C10.1 C11.2 C14.2 C16.2 C18.2 C19.2 C20.2 C23.2 C27.2 C29.2 IC2.3(DVSS_OSC) IC2.15(PBTL) IC2.23(PGND) IC2.24(PGND) IC2.25(PGND) IC2.32(PGND) IC2.33(PGND) IC2.34(PGND) IC2.44(DVSS) IC2.46(DVSS) IC2.48(STEST) R13.1 R16.1
LCH_OUT+: C26.2 C27.1
LCH_OUT-: C2.1 L1.2
RCH_OUT+: C28.2 C29.1
RCH_OUT-: C11.1 L2.2
SND_I2C1_SCL: IC2.52(SCL)
SND_I2C1_SDA: IC2.53(SDA)
SND_I2S2_MCK: IC2.5(MCLK)
SND_I2S2_SCK: IC2.55(SCLK)
SND_I2S2_SD: IC2.54(SDIN)
SND_I2S2_WS: IC2.56(LRCLK)
SND_RST: IC2.49(~{RESET}) R14.1
SUB_OUT+: C14.1 L3.2
SUB_OUT-: C19.1 L4.2
VR_ANA: C21.1 IC2.10(VR_ANA) R11.1
NetC12_1: C12.1 IC2.20(OUT_A) IC2.21(OUT_A) L1.1
NetC12_2: C12.2 IC2.17(BST_A)
NetC13_1: C13.1 IC2.26(OUT_B) IC2.27(OUT_B) L2.1
NetC13_2: C13.2 IC2.28(BST_B)
NetC15_1: C15.1 IC2.30(OUT_C) IC2.31(OUT_C) L3.1
NetC15_2: C15.2 IC2.29(BST_C)
NetC16_1: C16.1 IC2.41(GVDD)
NetC17_1: C17.1 IC2.36(OUT_D) IC2.37(OUT_D) L4.1
NetC17_2: C17.2 IC2.40(BST_D)
NetC18_1: C18.1 C20.1 IC2.2(VR_DIG)
NetC21_2: C21.2 C24.2 IC2.11(FLTP)
NetC22_2: C22.2 C25.2 IC2.12(FLTM)
NetC23_1: C23.1 IC2.42(VREG)
NetC24_1: C24.1 R11.2
NetC25_1: C25.1 R12.2
NetIC2_1: IC2.1(~{PDN}) R15.1
NetIC2_4: IC2.4(OSC_RES) R13.2
NetIC2_8: IC2.8(ADR/~{FAULT}) R16.2

Not connected (* = marked no-connect by the designer): IC2 6(NC) 7(NC) 16(SSTIMER) 22(NC) 35(NC) 43(NC) 45(NC) 50(NC) 51(NC)

### Notes on the sheet
- Title
- Size:
- Date:
- A4
- Number:
- Time:
- Revision:
- Sheet
- of
- File:

### Library data of the parts
C2 C5-C25 = Cap Semi: Capacitor (Semiconductor SIM Model); Published: 8-Jun-2000; LatestRevisionDate: 29-May-2009; LatestRevisionNote: IPC-7351 Footprint Added.; PackageReference: C1206; Publisher: Altium Limited; PackageDescription: Chip Capacitor
C3 C4 C26-C29 = Cap Pol3: Polarized Capacitor (Surface Mount); pin to pad: 1>+ 2>-; Published: 8-Jun-2000; LatestRevisionDate: 29-May-2009; LatestRevisionNote: IPC-7351 Footprint Added.; PackageReference: C0805; Publisher: Altium Limited; PackageDescription: Chip Capacitor
IC2 = TAS5755MDFD: 2x50W(2x19W + 1x50W) Digital Input Class-D Audio Amplifier with Processing and 2.1 Mode Support
L1-L4 = Inductor: Code_IEC: 1005; Published: 8-Jun-2000; LatestRevisionDate: 29-May-2009; LatestRevisionNote: IPC-7351 Footprint Added.; PackageReference: 0402-A; Publisher: Altium Limited; PackageDescription: Chip Inductor; Code_JEITA: 0402
R11-R16 = Res3: Resistor; Published: 8-Jun-2000; LatestRevisionDate: 29-May-2009; LatestRevisionNote: IPC-7351 Footprint Added.; PackageReference: J1-0603; Publisher: Altium Limited; PackageDescription: Chip Resistor